# Altium project An_IF_Converter_V1.0.PrjPcb
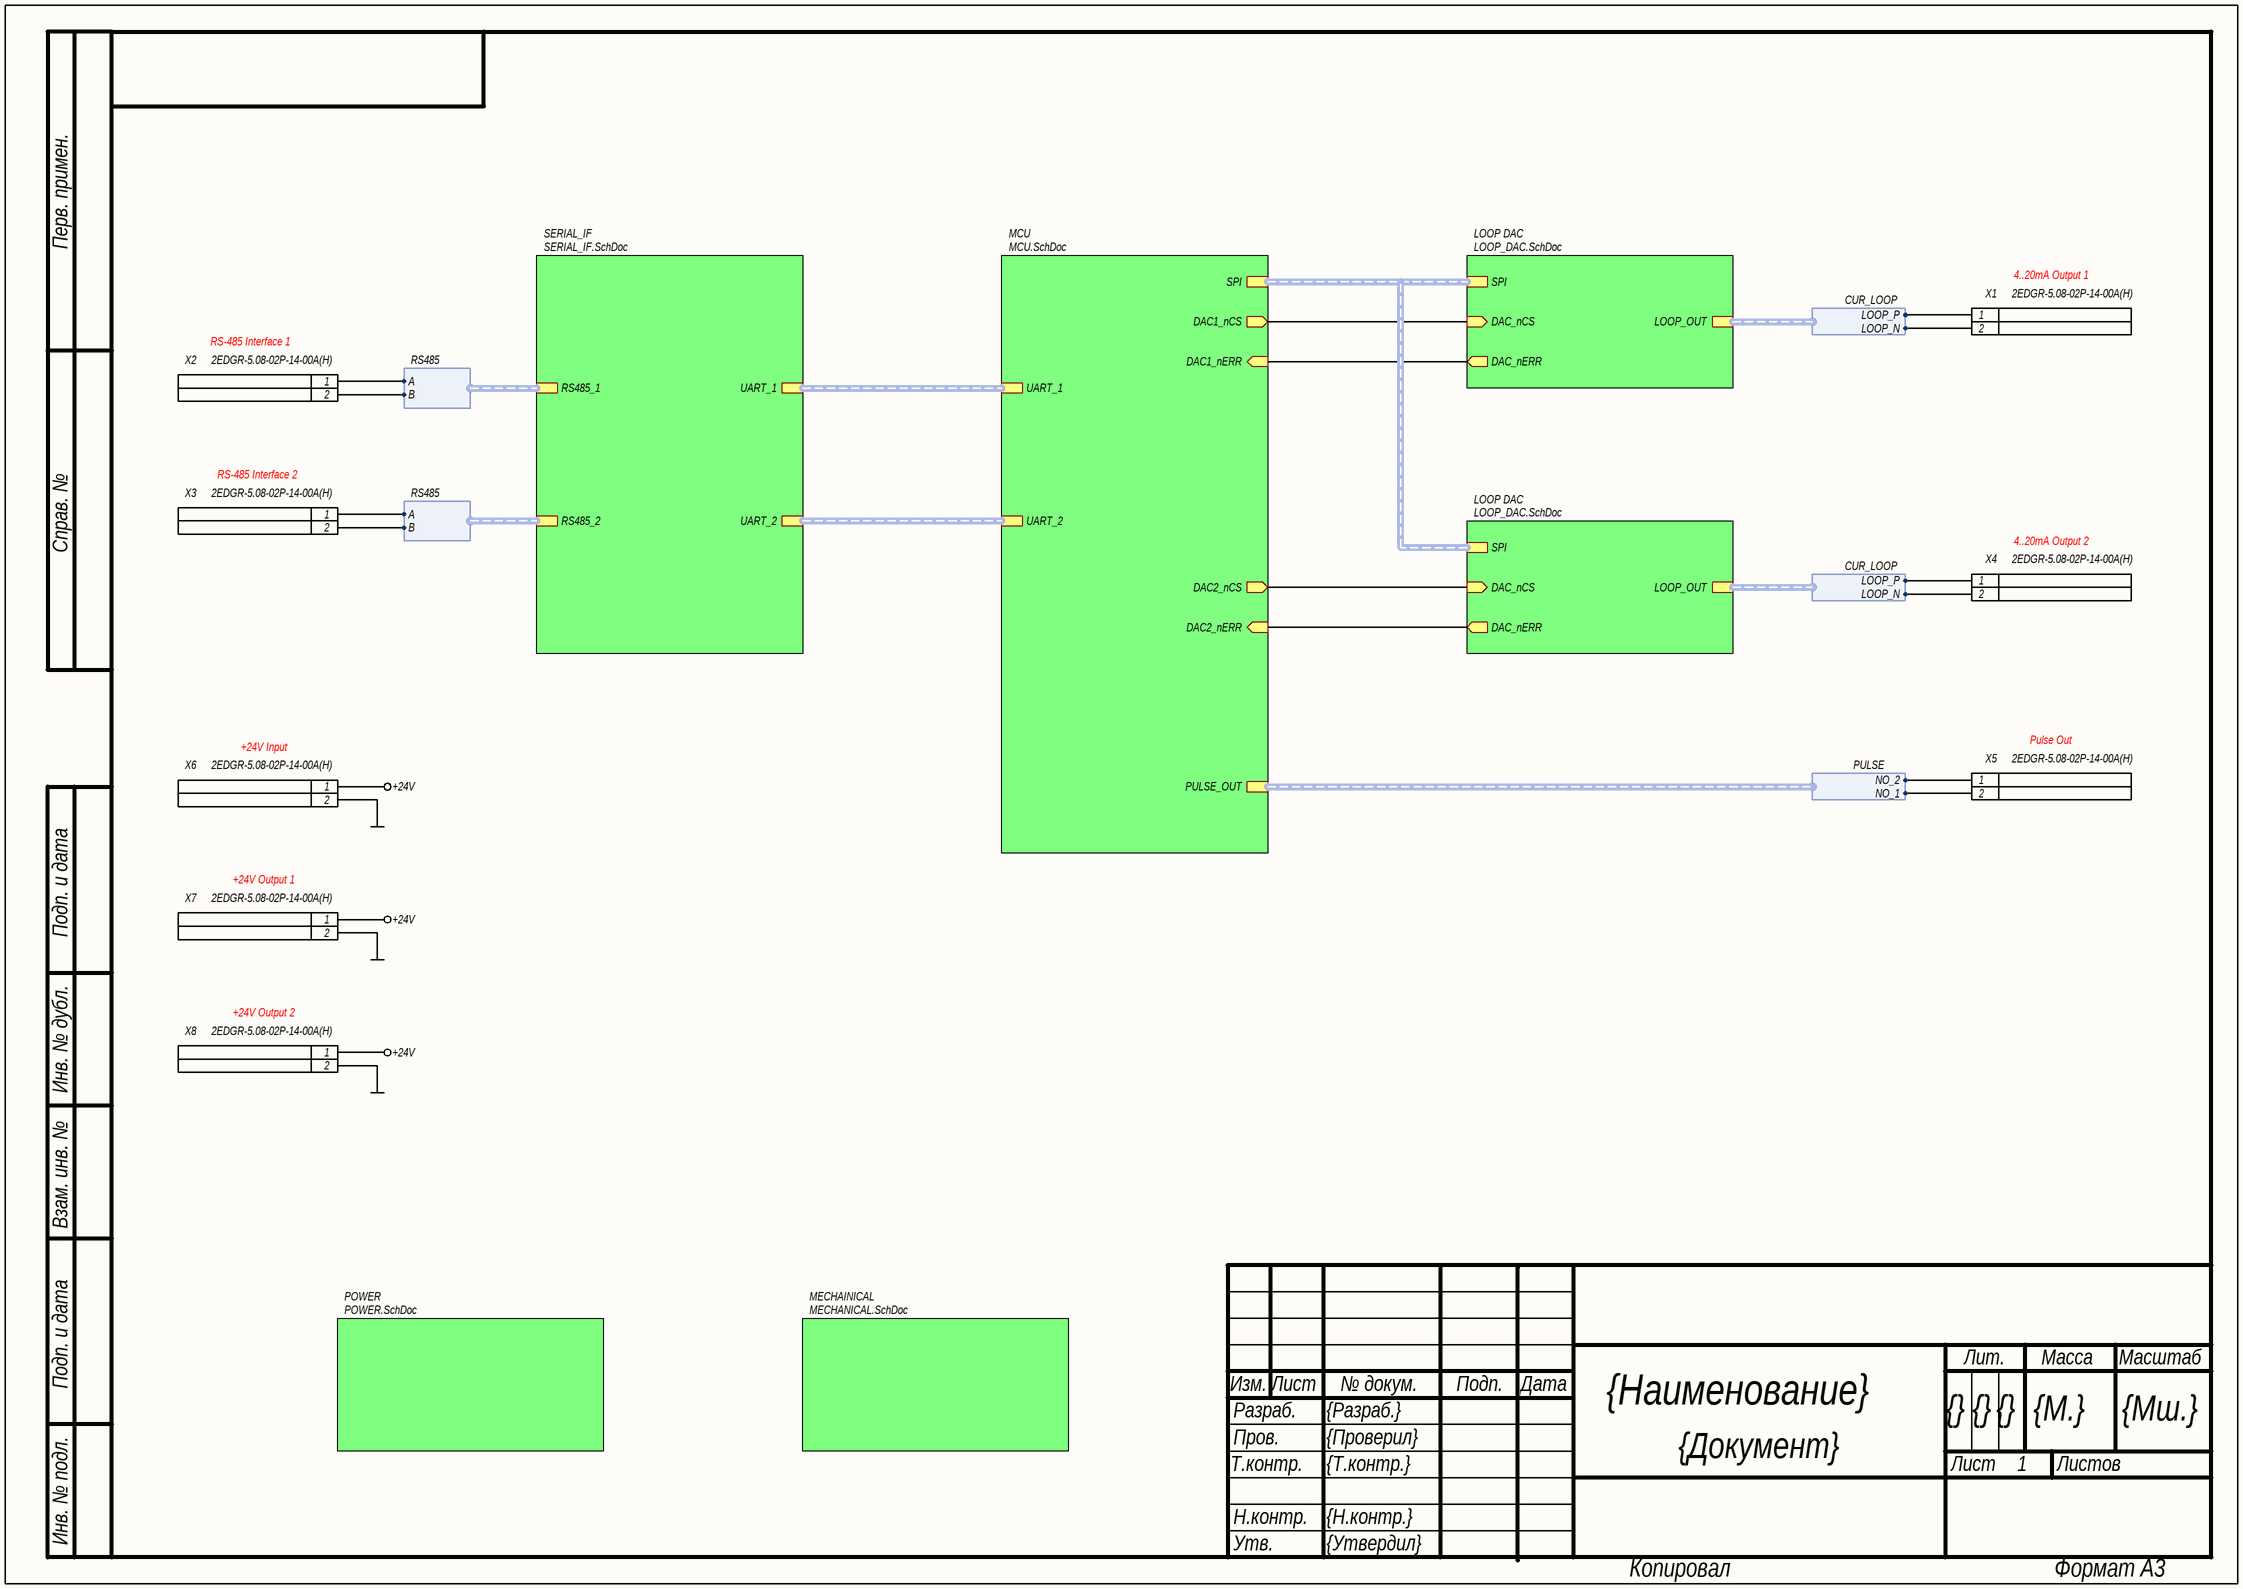
[diagram p0: TOP.SchDoc]
Total_Sheets: 6; Project_Name: AN IF Converter v.1.0
6 sheets, 157 parts. Net scope: hierarchical (ports join the sheet entries above them; power ports are global).
Board file: AN_IF_Converter_V1.0.PcbDoc
Sheets:
  TOP.SchDoc
    LOOP DAC = LOOP_DAC.SchDoc
    LOOP DAC = LOOP_DAC.SchDoc
    MCU = MCU.SchDoc
    SERIAL_IF = SERIAL_IF.SchDoc
    POWER = POWER.SchDoc
    MECHAINICAL = MECHANICAL.SchDoc

## Sheet TOP.SchDoc: {Наименование}
size 420 x 297 mm; ApprovedBy: {Утвердил}; CheckedBy: {Проверил}; DrawnBy: {Разраб.}; DocumentNumber: AN IF Converter v.1.0; SheetNumber: 1; SheetTotal: 6; Scale: {Мш.}; PageSetup: Record=PageOptions|CenterHorizontal=False|CenterVertical=False|PrintScale=0.95|XCorrection=0.00|YCorrection=0.00|PrintKind=1|BorderSize=5000000|LeftOffset=0|BottomOffset=0|Orientation=1|PaperLength=1000|PaperWidth=1000|Scale=100|PaperSource=15|PrintQuality=600|MediaType=1|DitherType=10|PaperKind=A4|PrintScaleMode=1; ProcessInspection: {Т.контр.}; Mass: {М.}; NormInspection: {Н.контр.}; Letter1Column: {}; Letter2Column: {}; Letter3Column: {}; DocumentType: {Документ}; Rule: PcbType=ProtelPcb

### Parts
X1  2EDGR-5.08-02P-14-00A(H)  [2EDGR-5.08-02P-14-00A(H)]
X2  2EDGR-5.08-02P-14-00A(H)  [2EDGR-5.08-02P-14-00A(H)]
X3  2EDGR-5.08-02P-14-00A(H)  [2EDGR-5.08-02P-14-00A(H)]
X4  2EDGR-5.08-02P-14-00A(H)  [2EDGR-5.08-02P-14-00A(H)]
X5  2EDGR-5.08-02P-14-00A(H)  [2EDGR-5.08-02P-14-00A(H)]
X6  2EDGR-5.08-02P-14-00A(H)  [2EDGR-5.08-02P-14-00A(H)]
X7  2EDGR-5.08-02P-14-00A(H)  [2EDGR-5.08-02P-14-00A(H)]
X8  2EDGR-5.08-02P-14-00A(H)  [2EDGR-5.08-02P-14-00A(H)]

### Sub-sheets
LOOP DAC = LOOP_DAC.SchDoc: DAC_nCS (in), DAC_nERR (out), LOOP_OUT (harness CUR_LOOP), SPI (harness SPI)
LOOP DAC = LOOP_DAC.SchDoc: DAC_nCS (in), DAC_nERR (out), LOOP_OUT (harness CUR_LOOP), SPI (harness SPI)
MCU = MCU.SchDoc: DAC1_nERR (in), SPI (harness SPI), DAC1_nCS (out), DAC2_nCS (out), DAC2_nERR (in), UART_2 (harness UART_CTRL), PULSE_OUT (harness PULSE), UART_1 (harness UART_CTRL)
MECHAINICAL = MECHANICAL.SchDoc: no entries
POWER = POWER.SchDoc: no entries
SERIAL_IF = SERIAL_IF.SchDoc: RS485_2 (harness RS485), RS485_1 (harness RS485), UART_2 (harness UART_CTRL), UART_1 (harness UART_CTRL)

### Harnesses
CUR_LOOP: LOOP_P, LOOP_N
RS485: A, B
PULSE: NO_1, NO_2

### Nets
+24V: X6.1 X7.1 X8.1
GND: X6.2 X7.2 X8.2
MCU_DAC1_nCS: sheet LOOP DAC/DAC_nCS, sheet MCU/DAC1_nCS
MCU_DAC1_nERR: sheet LOOP DAC/DAC_nERR, sheet MCU/DAC1_nERR
MCU_DAC2_nCS: sheet LOOP DAC/DAC_nCS, sheet MCU/DAC2_nCS
MCU_DAC2_nERR: sheet LOOP DAC/DAC_nERR, sheet MCU/DAC2_nERR
RS485_A_N: X2.2 ; sheet SERIAL_IF/RS485_1.B
RS485_A_P: X2.1 ; sheet SERIAL_IF/RS485_1.A
RS485_B_N: X3.2 ; sheet SERIAL_IF/RS485_2.B
RS485_B_P: X3.1 ; sheet SERIAL_IF/RS485_2.A
Net1DA2_5: X1.2 ; sheet LOOP DAC/LOOP_OUT.LOOP_N
Net1FU1_1: X1.1 ; sheet LOOP DAC/LOOP_OUT.LOOP_P
Net2DA2_5: X4.2 ; sheet LOOP DAC/LOOP_OUT.LOOP_N
Net2FU1_1: X4.1 ; sheet LOOP DAC/LOOP_OUT.LOOP_P
NetFU2_1: X5.1 ; sheet MCU/PULSE_OUT.NO_2
NetU1_4: X5.2 ; sheet MCU/PULSE_OUT.NO_1

### Buses and harness runs
harness sheet LOOP DAC/SPI = sheet MCU/SPI
harness sheet MCU/UART_1 = sheet SERIAL_IF/UART_1
harness sheet MCU/UART_2 = sheet SERIAL_IF/UART_2

### Notes on the sheet
- (near X1) 4..20mA Output 1
- (near X2) RS-485 Interface 1
- (near X3) RS-485 Interface 2
- (near X4) 4..20mA Output 2
- Pulse Out
- +24V Input
- (near X7) +24V Output 1
- (near X8) +24V Output 2
- Перв. примен.
- Справ. №
- Подп. и дата
- Инв. № дубл.
- Взам. инв. №
- Изм.
- Лист
- № докум.
- Подп.
- Дата
- Лит.
- Масса
- Масштаб
- Т.контр.
- Пров.
- Разраб.
- Листов
- Инв. № подл.
- Н.контр.
- Утв.
- Копировал
- Формат А3

### Library data of the parts
X1-X8 = 2EDGR-5.08-02P-14-00A(H): Разъем, 2 контакта; Тип разъема: Pluggable terminal block; Количество контактов: 2; Шаг контактов: 5.08mm; Ток: 20A; Напряжение: 320V; Производитель: Degson Electronics; Описание: Pluggable terminal block; 5.08m; ways: 2; angled 90; socket; male; Температурный диапазон: -40°C ~ 105°C; Вид монтажа: Through Hole; Артикул: 2EDGR-5.08-02P-14-00A(H); Строка для документации: https://static.chipdip.ru/lib/044/DOC013044846.pdf; Тип элемента: Разъем

## Sheet LOOP_DAC.SchDoc: {Наименование}
size 420 x 297 mm; ApprovedBy: {Утвердил}; CheckedBy: {Проверил}; DrawnBy: {Разраб.}; DocumentNumber: AN IF Converter v.1.0; SheetNumber: 2; SheetTotal: 6; Scale: {Мш.}; PageSetup: Record=PageOptions|CenterHorizontal=False|CenterVertical=False|PrintScale=0.95|XCorrection=0.00|YCorrection=0.00|PrintKind=1|BorderSize=5000000|LeftOffset=0|BottomOffset=0|Orientation=1|PaperLength=1000|PaperWidth=1000|Scale=100|PaperSource=15|PrintQuality=600|MediaType=1|DitherType=10|PaperKind=A4|PrintScaleMode=1; ProcessInspection: {Т.контр.}; Mass: {М.}; NormInspection: {Н.контр.}; Letter1Column: {}; Letter2Column: {}; Letter3Column: {}; DocumentType: {Документ}; Rule: PcbType=ProtelPcb
Used 2 times, as channels LOOP DAC, LOOP DAC. Parts and nets are listed once, with the designators drawn on the sheet.
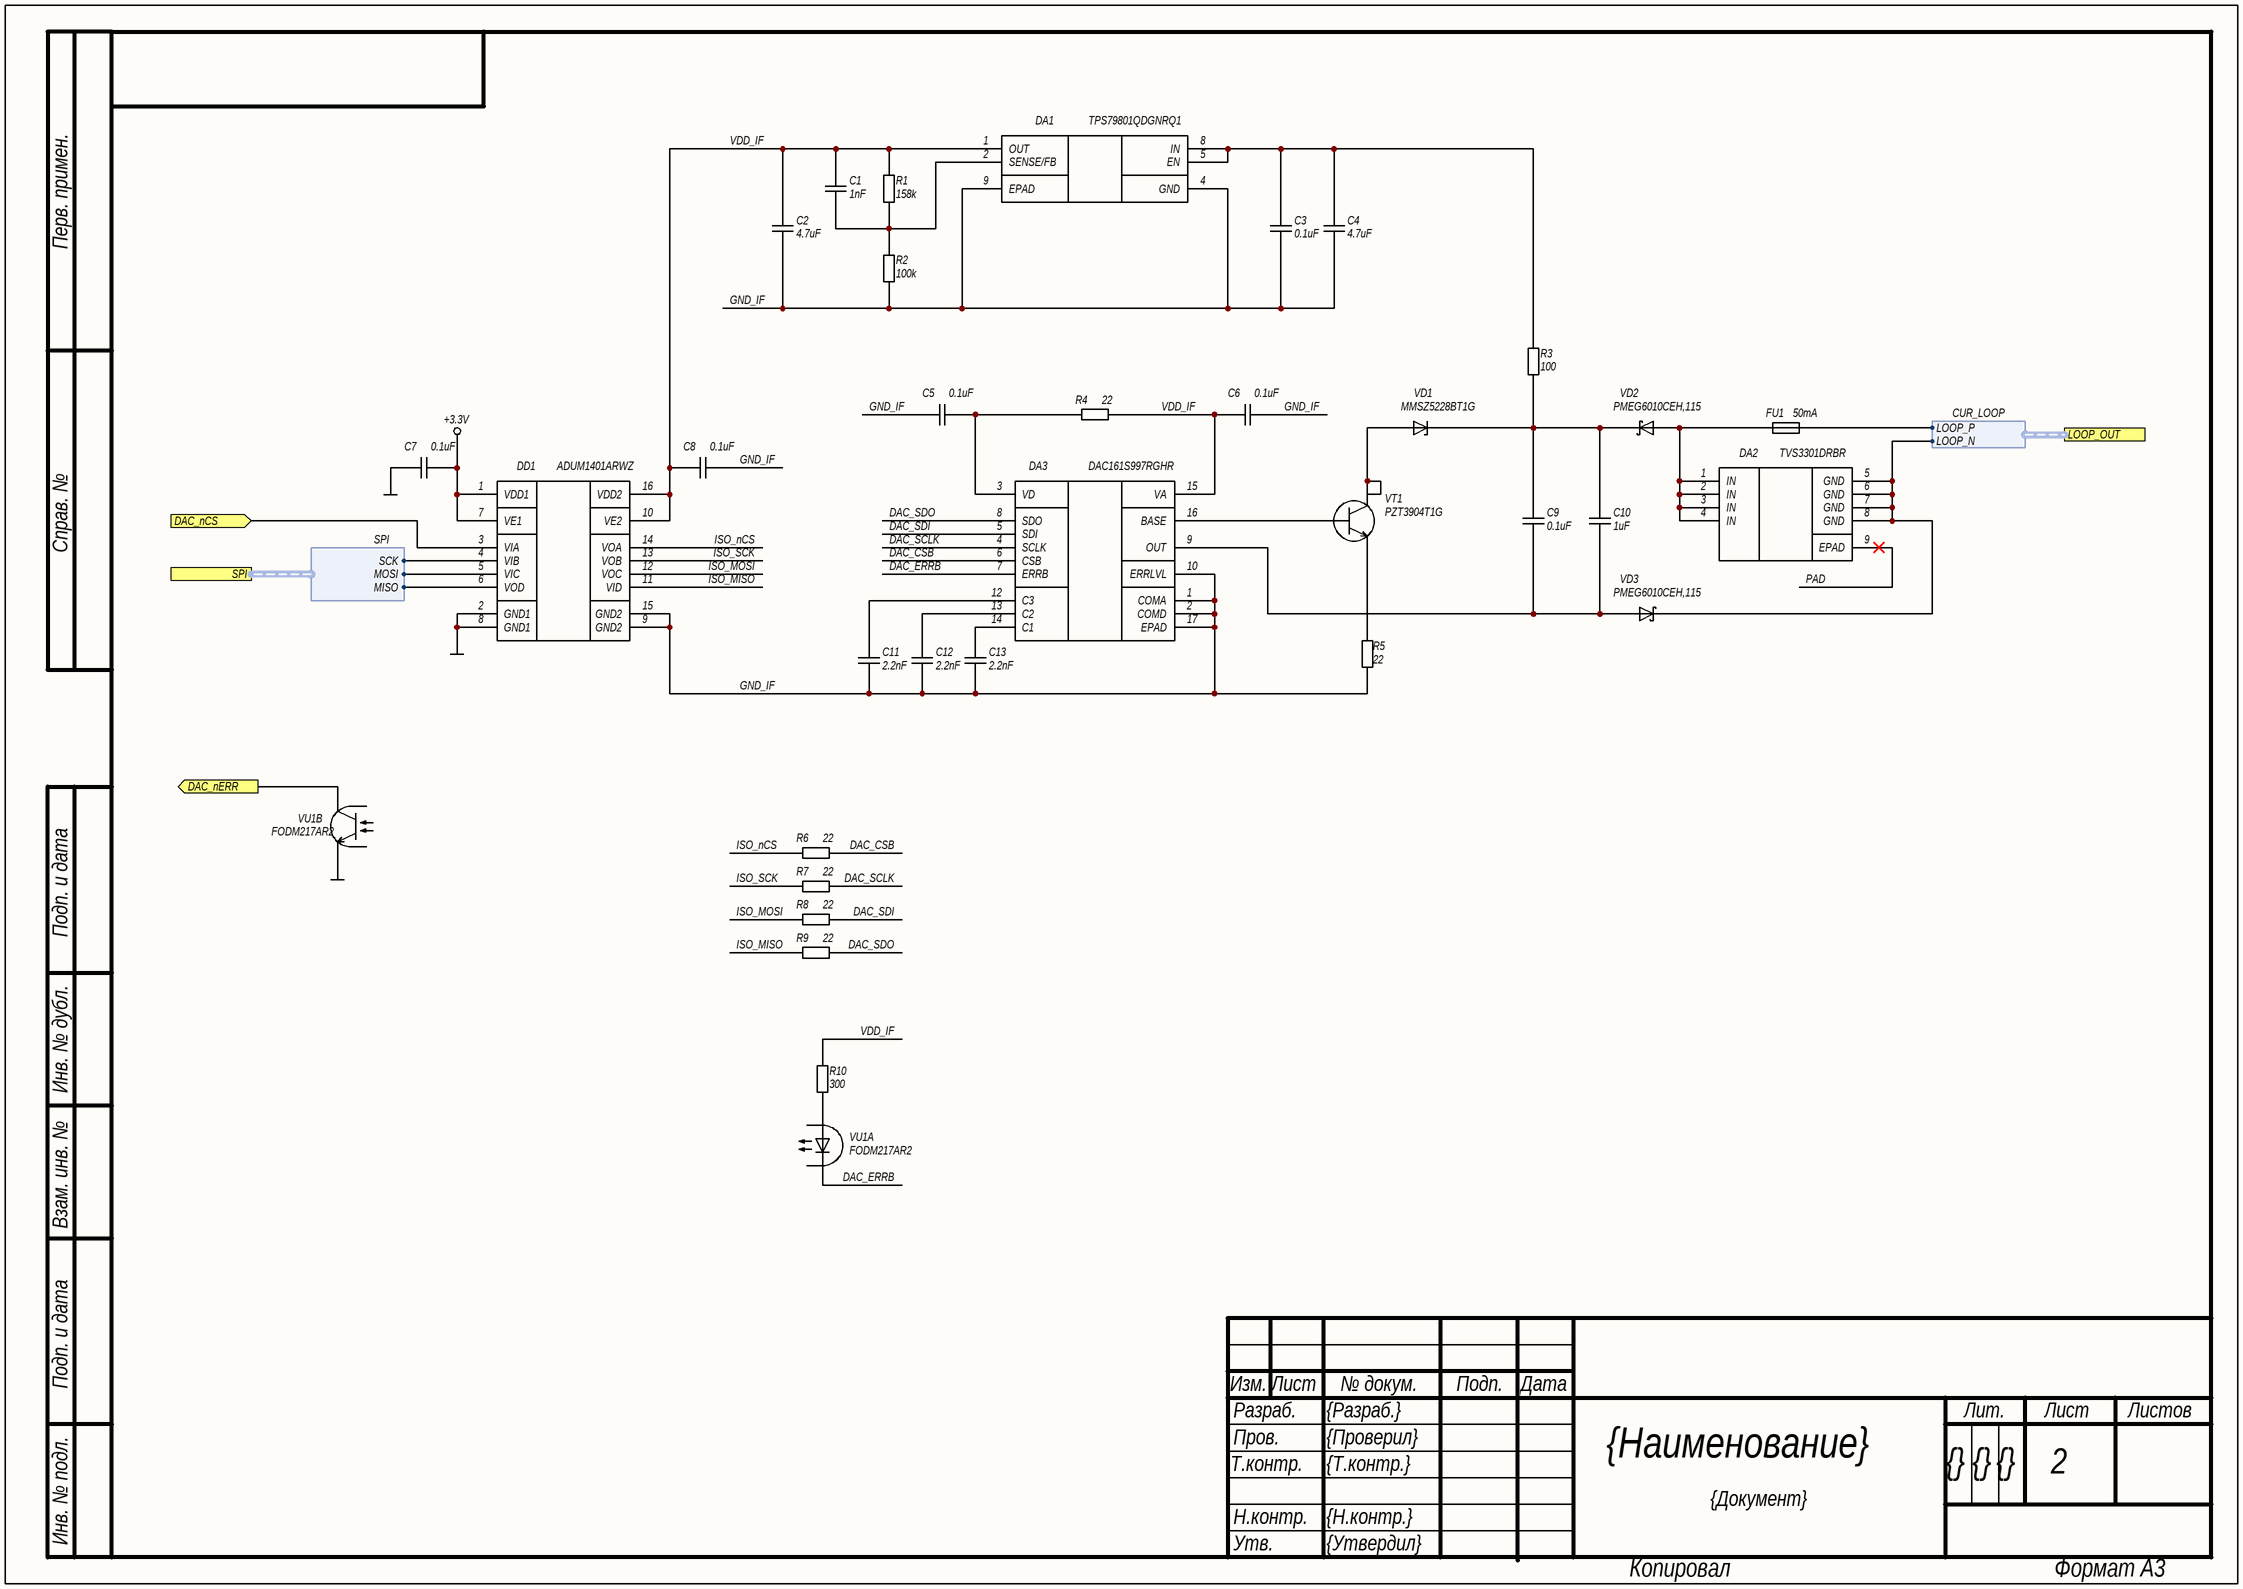
[diagram p1: LOOP_DAC.SchDoc]

### Parts
C1  1nF  [C0603N]
C2  4.7uF  [C0805N]
C3  0.1uF  [C0603N]
C4  4.7uF  [C1206N]
C5  0.1uF  [C0603N]
C6  0.1uF  [C0603N]
C7  0.1uF  [C0603N]
C8  0.1uF  [C0603N]
C9  0.1uF  [C0603N]
C10  1uF  [C0603N]
C11  2.2nF  [C0603N]
C12  2.2nF  [C0603N]
C13  2.2nF  [C0603N]
DA1  TPS79801QDGNRQ1  [DGN0008B]
DA2  TVS3301DRBR  [DRB0008A]
DA3  DAC161S997RGHR  [RGH0016A]
DD1  ADUM1401ARWZ  [SOIC16_W]
FU1  50mA  [0ZCJ_0.85]
R1  158k  [R0603N]
R2  100k  [R0603N]
R3  100  [R0603N]
R4  22  [R0603N]
R5  22  [R0603N]
R6  22  [R0603N]
R7  22  [R0603N]
R8  22  [R0603N]
R9  22  [R0603N]
R10  300  [R0603N]
VD1  MMSZ5228BT1G  [SOD123]
VD2  PMEG6010CEH,115  [SOD123F]
VD3  PMEG6010CEH,115  [SOD123F]
VT1  PZT3904T1G  [SOT223]
VU1  FODM217AR2  [MFP4 2.5x4.4]  (parts A,B of 2)

### Ports
DAC_nCS (in), DAC_nERR (out), LOOP_OUT (harness CUR_LOOP), SPI (harness SPI)

### Harnesses
SPI: MISO, MOSI, SCK
CUR_LOOP: LOOP_P, LOOP_N

### Nets
+3.3V: C7.1 DD1.1(VDD1) DD1.7(VE1)
GND: C7.2 DD1.2(GND1) DD1.8(GND1) VU1.3(E)
DAC_CSB: DA3.6(CSB) R6.1
DAC_ERRB: DA3.7(ERRB) VU1.2(K)
DAC_nCS: DD1.3(VIA) ; port DAC_nCS
DAC_nERR: VU1.4(C) ; port DAC_nERR
DAC_SCLK: DA3.4(SCLK) R7.1
DAC_SDI: DA3.5(SDI) R8.1
DAC_SDO: DA3.8(SDO) R9.1
GND_IF: C2.2 C3.1 C4.2 C5.2 C6.1 C8.1 C11.1 C12.1 C13.1 DA1.4(GND) DA1.9(EPAD) DA3.1(COMA) DA3.2(COMD) DA3.10(ERRLVL) DA3.17(EPAD) DD1.9(GND2) DD1.15(GND2) R2.2 R5.2
ISO_MISO: DD1.11(VID) R9.2
ISO_MOSI: DD1.12(VOC) R8.2
ISO_nCS: DD1.14(VOA) R6.2
ISO_SCK: DD1.13(VOB) R7.2
PAD: DA2.9(EPAD)
VDD_IF: C1.1 C2.1 C6.2 C8.2 DA1.1(OUT) DA3.15(VA) DD1.10(VE2) DD1.16(VDD2) R1.1 R4.1 R10.1
NetC1_2: C1.2 DA1.2(SENSE/FB) R1.2 R2.1
NetC3_2: C3.2 C4.1 DA1.5(EN) DA1.8(IN) R3.1
NetC5_1: C5.1 DA3.3(VD) R4.2
NetC9_1: C9.1 C10.1 R3.2 VD1.1(K) VD2.1(K)
NetC9_2: C9.2 C10.2 DA3.9(OUT) VD3.2(A)
NetC11_2: C11.2 DA3.12(C3)
NetC12_2: C12.2 DA3.13(C2)
NetC13_2: C13.2 DA3.14(C1)
NetDA2_1: DA2.1(IN) DA2.2(IN) DA2.3(IN) DA2.4(IN) FU1.2 VD2.2(A)
NetDA2_5: DA2.5(GND) DA2.6(GND) DA2.7(GND) DA2.8(GND) VD3.1(K) ; port LOOP_OUT.LOOP_N
NetDA3_16: DA3.16(BASE) VT1.1(B)
NetDD1_4: DD1.4(VIB) ; port SPI.SCK
NetDD1_5: DD1.5(VIC) ; port SPI.MOSI
NetDD1_6: DD1.6(VOD) ; port SPI.MISO
NetFU1_1: FU1.1 ; port LOOP_OUT.LOOP_P
NetR5_1: R5.1 VT1.3(E)
NetR10_2: R10.2 VU1.1(A)
NetVD1_2: VD1.2(A) VT1.2(C) VT1.4(C)

### Channels
LOOP DAC: designators C1=1C1 C2=1C2 C3=1C3 C4=1C4 C5=1C5 C6=1C6 C7=1C7 C8=1C8 C9=1C9 C10=1C10 C11=1C11 C12=1C12 C13=1C13 DA1=1DA1 DA2=1DA2 DA3=1DA3 DD1=1DD1 FU1=1FU1 R1=1R1 R2=1R2 R3=1R3 R4=1R4 R5=1R5 R6=1R6 R7=1R7 R8=1R8 R9=1R9 R10=1R10 VD1=1VD1 VD2=1VD2 VD3=1VD3 VT1=1VT1 VU1=1VU1; ports DAC_nCS=MCU_DAC1_nCS DAC_nERR=MCU_DAC1_nERR
LOOP DAC: designators C1=2C1 C2=2C2 C3=2C3 C4=2C4 C5=2C5 C6=2C6 C7=2C7 C8=2C8 C9=2C9 C10=2C10 C11=2C11 C12=2C12 C13=2C13 DA1=2DA1 DA2=2DA2 DA3=2DA3 DD1=2DD1 FU1=2FU1 R1=2R1 R2=2R2 R3=2R3 R4=2R4 R5=2R5 R6=2R6 R7=2R7 R8=2R8 R9=2R9 R10=2R10 VD1=2VD1 VD2=2VD2 VD3=2VD3 VT1=2VT1 VU1=2VU1; ports DAC_nCS=MCU_DAC2_nCS DAC_nERR=MCU_DAC2_nERR

### Notes on the sheet
- Перв. примен.
- Справ. №
- Подп. и дата
- Инв. № дубл.
- Взам. инв. №
- Изм.
- Лист
- № докум.
- Подп.
- Дата
- Т.контр.
- Пров.
- Разраб.
- Лит.
- Листов
- Инв. № подл.
- Н.контр.
- Утв.
- Копировал
- Формат А3

### Library data of the parts
C1 = CL10B102KC8NNNC: Конденсатор; Точность: 10%; Напряжение: 100V; Диэлектрик: X7R; Производитель: Samsung Electro-Mechanics; Описание: 1000 pF ±10% 100V Ceramic Capacitor X7R 0603 (1608 Metric); Корпус: 0603 (1608 Metric); Температурный диапазон: -55°C ~ 125°C; Вид монтажа: SMD; Артикул: CL10B102KC8NNNC; Номинал: 1nF; Строка для документации: https://mm.digikey.com/Volume0/opasdata/d220001/medias/docus/1136/CL10B102KC8NNNC_Spec.pdf; Тип элемента: Конденсатор
C2 = CL21A475KAQNNNG: Конденсатор; Точность: 10%; Напряжение: 25V; Диэлектрик: X5R; Производитель: Samsung Electro-Mechanics; Описание: 4.7 µF ±10% 25V Ceramic Capacitor X5R 0805 (2012 Metric); Корпус: 0805 (2012 Metric); Температурный диапазон: -55°C ~ 85°C; Вид монтажа: SMD; Артикул: CL21A475KAQNNNG; Номинал: 4.7uF; Строка для документации: https://mm.digikey.com/Volume0/opasdata/d220001/medias/docus/41/CL21A475KAQNNNG_DS.pdf; Тип элемента: Конденсатор
C3 C5-C9 = CL10B104KB8NNNC: Конденсатор; Точность: 10%; Напряжение: 50V; Диэлектрик: X7R; Производитель: Samsung Electro-Mechanics; Описание: 0.1 µF ±10% 50V Ceramic Capacitor X7R 0603 (1608 Metric); Корпус: 0603 (1608 Metric); Температурный диапазон: -55°C ~ 125°C; Вид монтажа: SMD; Артикул: CL10B104KB8NNNC; Номинал: 0.1uF; Строка для документации: https://mm.digikey.com/Volume0/opasdata/d220001/medias/docus/609/CL10B104KB8NNNC_Spec.pdf; Тип элемента: Конденсатор
C4 = CC1206KKX7R9BB475: Конденсатор; Точность: 10%; Напряжение: 50V; Диэлектрик: X7R; Производитель: YAGEO; Описание: 4.7 µF ±10% 50V Ceramic Capacitor X7R 1206 (3216 Metric); Корпус: 1206 (3216 Metric); Строка для документации: ttps://www.yageo.com/upload/media/product/productsearch/datasheet/mlcc/UPY-NP0X7R_HV_1KV-to-3KV_13.pdf; Температурный диапазон: -55°C ~ 125°C; Вид монтажа: SMD; Артикул: CC1206KKX7R9BB475; Номинал: 4.7uF; Тип элемента: Конденсатор
C10 = CC0603KRX7R9BB105: Конденсатор; Точность: 10%; Напряжение: 50V; Диэлектрик: X7R; Производитель: YAGEO; Описание: 1 µF ±10% 50V Ceramic Capacitor X7R 0603 (1608 Metric); Корпус: 0603 (1608 Metric); Температурный диапазон: -55°C ~ 125°C; Вид монтажа: SMD; Артикул: CC0603KRX7R9BB105; Номинал: 1uF; Строка для документации: https://www.yageo.com/upload/media/product/productsearch/datasheet/mlcc/UPY-GPHC_X7R_6.3V-to-250V_24.pdf; Тип элемента: Конденсатор
C11-C13 = CC0603JRNPO9BN222: Конденсатор; Точность: 5%; Напряжение: 50V; Диэлектрик: NP0; Производитель: YAGEO; Описание: 2200 pF ±5% 50V Ceramic Capacitor C0G, NP0 0603 (1608 Metric); Корпус: 0603 (1608 Metric); Температурный диапазон: -55°C ~ 125°C; Вид монтажа: SMD; Артикул: CC0603JRNPO9BN222; Номинал: 2.2nF; Строка для документации: https://www.yageo.com/upload/media/product/productsearch/datasheet/mlcc/UPY-GPHC_X7R_6.3V-to-250V_24.pdf; Тип элемента: Конденсатор
DA1 = TPS79801QDGNRQ1: Микросхема линейный стабилизатор напряжения; Производитель: Texas Instruments; Описание: Linear Voltage Regulator IC Positive Adjustable 1 Output 50mA 8-HVSSOP; Корпус: 8-HVSSOP; Температурный диапазон: -40°C ~ 125°C; Вид монтажа: SMD; Артикул: TPS79801QDGNRQ1; Строка для документации: https://www.ti.com/lit/ds/symlink/tps798-q1.pdf; Тип элемента: Микросхема
DA2 = TVS3301DRBR: Микросхема ограничитель выбросов напряжения; Напряжение: 33V; Напряжение ограничения: 42.5V; Напряжение пробоя: 37.5V; Ток: 27A; Тип: TVS Unidirectional; Производитель: Texas Instruments; Описание: Mixed Technology TVS Device Circuit 42.5V Surface Mount 8-SON (3x3); Корпус: 8-SON (3x3); Температурный диапазон: -40°C ~ 125°C (TA); Вид монтажа: SMD; Тип элемента: Диод защитный; Артикул: TVS3301DRBR; Строка для документации: https://www.ti.com/lit/ds/symlink/tvs3301.pdf
DA3 = DAC161S997RGHR: Микросхема 16-бит ЦАП с токовым выходом 4-20mA; Производитель: Texas Instruments; Описание: 16-Bit SPI-Programmable DAC for 4-20 mA Loops 16-WQFN (4x4); Корпус: 16-WFQFN Exposed Pad; Температурный диапазон: -40°C ~ 105°C; Вид монтажа: SMD; Артикул: DAC161S997RGHR; Строка для документации: https://www.ti.com/lit/ds/symlink/dac161s997.pdf; Тип элемента: Микросхема
DD1 = ADUM1401ARWZ: Микросхема цифровой изолятор интерфейса; Производитель: Analog Devices Inc.; Описание: General Purpose Digital Isolator 2500Vrms 4 Channel 1Mbps 25kV/µs CMTI 16-SOIC (0.295", 7.50mm Width); Корпус: 16-SOIC (0.295", 7.50mm Width); Температурный диапазон: -40°C ~ 105°C; Вид монтажа: SMD; Артикул: ADUM1401ARWZ; Строка для документации: https://www.analog.com/media/en/technical-documentation/data-sheets/ADuM1400_1401_1402.pdf; Тип элемента: Микросхема
FU1 = 0ZCJ0005FF2E: Плавкий предохранитель; Напряжение: 60V; Тип: PTC Resettable Fuse; Производитель: Bel Fuse Inc.; Описание: Polymeric PTC Resettable Fuse 60V 50 mA Ih Surface Mount 1206 (3216 Metric), Concave; Корпус: 1206 (3216 Metric), Concave; Температурный диапазон: -40°C ~ 85°C; Вид монтажа: SMD; Артикул: 0ZCJ0005FF2E; Ток: 50mA; Строка для документации: https://www.belfuse.com/resources/datasheets/circuitprotection/ds-cp-0zcj-series.pdf; Тип элемента: Предохранитель
R1 = RC0603FR-07158KL: Резистор; Точность: 1%; ТКС: ±100ppm/°C; Напряжение: 75V; Производитель: YAGEO; Описание: 158 kOhms ±1% 0.1W, 1/10W Chip Resistor 0603 (1608 Metric) Moisture Resistant Thick Film; Корпус: 0603 (1608 Metric); Температурный диапазон: -55°C ~ 155°C; Вид монтажа: SMD; Артикул: RC0603FR-07158KL; Номинал: 158k; Строка для документации: https://www.yageo.com/upload/media/product/app/datasheet/rchip/pyu-rc_group_51_rohs_l.pdf; Тип элемента: Резистор
R2 = RC0603FR-07100KL: Резистор; Точность: 1%; ТКС: ±100ppm/°C; Напряжение: 75V; Производитель: YAGEO; Описание: 100 kOhms ±1% 0.1W, 1/10W Chip Resistor 0603 (1608 Metric) Moisture Resistant Thick Film; Корпус: 0603 (1608 Metric); Температурный диапазон: -55°C ~ 155°C; Вид монтажа: SMD; Артикул: RC0603FR-07100KL; Номинал: 100k; Строка для документации: https://www.yageo.com/upload/media/product/app/datasheet/rchip/pyu-rc_group_51_rohs_l.pdf; Тип элемента: Резистор
R3 = RC0603FR-07100RL: Резистор; Точность: 1%; ТКС: ±100ppm/°C; Напряжение: 75V; Производитель: YAGEO; Описание: 100 Ohms ±1% 0.1W, 1/10W Chip Resistor 0603 (1608 Metric) Moisture Resistant Thick Film; Корпус: 0603 (1608 Metric); Температурный диапазон: -55°C ~ 155°C; Вид монтажа: SMD; Артикул: RC0603FR-07100RL; Номинал: 100; Строка для документации: https://www.yageo.com/upload/media/product/app/datasheet/rchip/pyu-rc_group_51_rohs_l.pdf; Тип элемента: Резистор
R4-R9 = RC0603FR-0722RL: Резистор; Точность: 1%; ТКС: ±100ppm/°C; Напряжение: 75V; Производитель: YAGEO; Описание: 22 Ohms ±1% 0.1W, 1/10W Chip Resistor 0603 (1608 Metric) Moisture Resistant Thick Film; Корпус: 0603 (1608 Metric); Температурный диапазон: -55°C ~ 155°C; Вид монтажа: SMD; Артикул: RC0603FR-0722RL; Номинал: 22; Строка для документации: https://www.yageo.com/upload/media/product/app/datasheet/rchip/pyu-rc_group_51_rohs_l.pdf; Тип элемента: Резистор
R10 = RC0603FR-07300RL: Резистор; Точность: 1%; ТКС: ±100ppm/°C; Напряжение: 75V; Производитель: YAGEO; Описание: 300 Ohms ±1% 0.1W, 1/10W Chip Resistor 0603 (1608 Metric) Moisture Resistant Thick Film; Корпус: 0603 (1608 Metric); Температурный диапазон: -55°C ~ 155°C; Вид монтажа: SMD; Артикул: RC0603FR-07300RL; Номинал: 300; Строка для документации: https://www.yageo.com/upload/media/product/app/datasheet/rchip/pyu-rc_group_51_rohs_l.pdf; Тип элемента: Резистор
VD1 = MMSZ5228BT1G: Стабилитрон; Прямой ток: 20mA; Напряжение: 3.9V; Производитель: onsemi; Описание: Zener Diode 3.9 V 500 mW ±5% Surface Mount SOD-123; Корпус: SOD-123; Температурный диапазон: -55°C ~ 150°C; Вид монтажа: SMD; Тип элемента: Диод; Артикул: MMSZ5228BT1G; Тип: Zener; Строка для документации: https://www.onsemi.com/pdf/datasheet/mmsz5221bt1-d.pdf
VD2 VD3 = PMEG6010CEH,115: Диод Шоттки; Прямой ток: 1A; Напряжение: 60V; Производитель: Nexperia USA Inc.; Описание: Diode 60 V 1A Surface Mount SOD-123F; Корпус: SOD-123F; Температурный диапазон: -65°C ~ 150°C; Вид монтажа: SMD; Артикул: PMEG6010CEH,115; Тип: Schottky; Строка для документации: https://assets.nexperia.com/documents/data-sheet/PMEG6010CEH.pdf; Тип элемента: Диод
VT1 = PZT3904T1G: Биполярный транзистор, NPN структуры; Ток: 0.2A; Напряжение: 40V; Производитель: onsemi; Описание: Bipolar (BJT) Transistor NPN 40 V 200 mA 300MHz 1.5 W Surface Mount SOT-223 (TO-261); Корпус: SOT-223 (TO-261); Температурный диапазон: -55°C ~ 150°C (TJ); Вид монтажа: SMD; Тип элемента: Транзистор биполярный; Артикул: PZT3904T1G; Тип: NPN
VU1 = FODM217AR2: NPN транзисторная оптопара; Прямой ток: 50mA; Напряжение: 1.2V; Производитель: onsemi; Описание: Optoisolator Transistor Output 3750Vrms 1 Channel 4-SOP; Корпус: 4-SOIC (0.173", 4.40mm Width); Температурный диапазон: -55°C ~ 110°C; Вид монтажа: SMD; Артикул: FODM217AR2; Строка для документации: https://www.onsemi.com/pdf/datasheet/fodm214-d.pdf; Тип элемента: Транзисторная оптопара

## Sheet MCU.SchDoc: {Наименование}
size 420 x 297 mm; ApprovedBy: {Утвердил}; CheckedBy: {Проверил}; DrawnBy: {Разраб.}; DocumentNumber: AN IF Converter v.1.0; SheetNumber: 3; SheetTotal: 6; Scale: {Мш.}; PageSetup: Record=PageOptions|CenterHorizontal=False|CenterVertical=False|PrintScale=0.95|XCorrection=0.00|YCorrection=0.00|PrintKind=1|BorderSize=5000000|LeftOffset=0|BottomOffset=0|Orientation=1|PaperLength=1000|PaperWidth=1000|Scale=100|PaperSource=15|PrintQuality=600|MediaType=1|DitherType=10|PaperKind=A4|PrintScaleMode=1; ProcessInspection: {Т.контр.}; Mass: {М.}; NormInspection: {Н.контр.}; Letter1Column: {}; Letter2Column: {}; Letter3Column: {}; DocumentType: {Документ}; Rule: PcbType=ProtelPcb
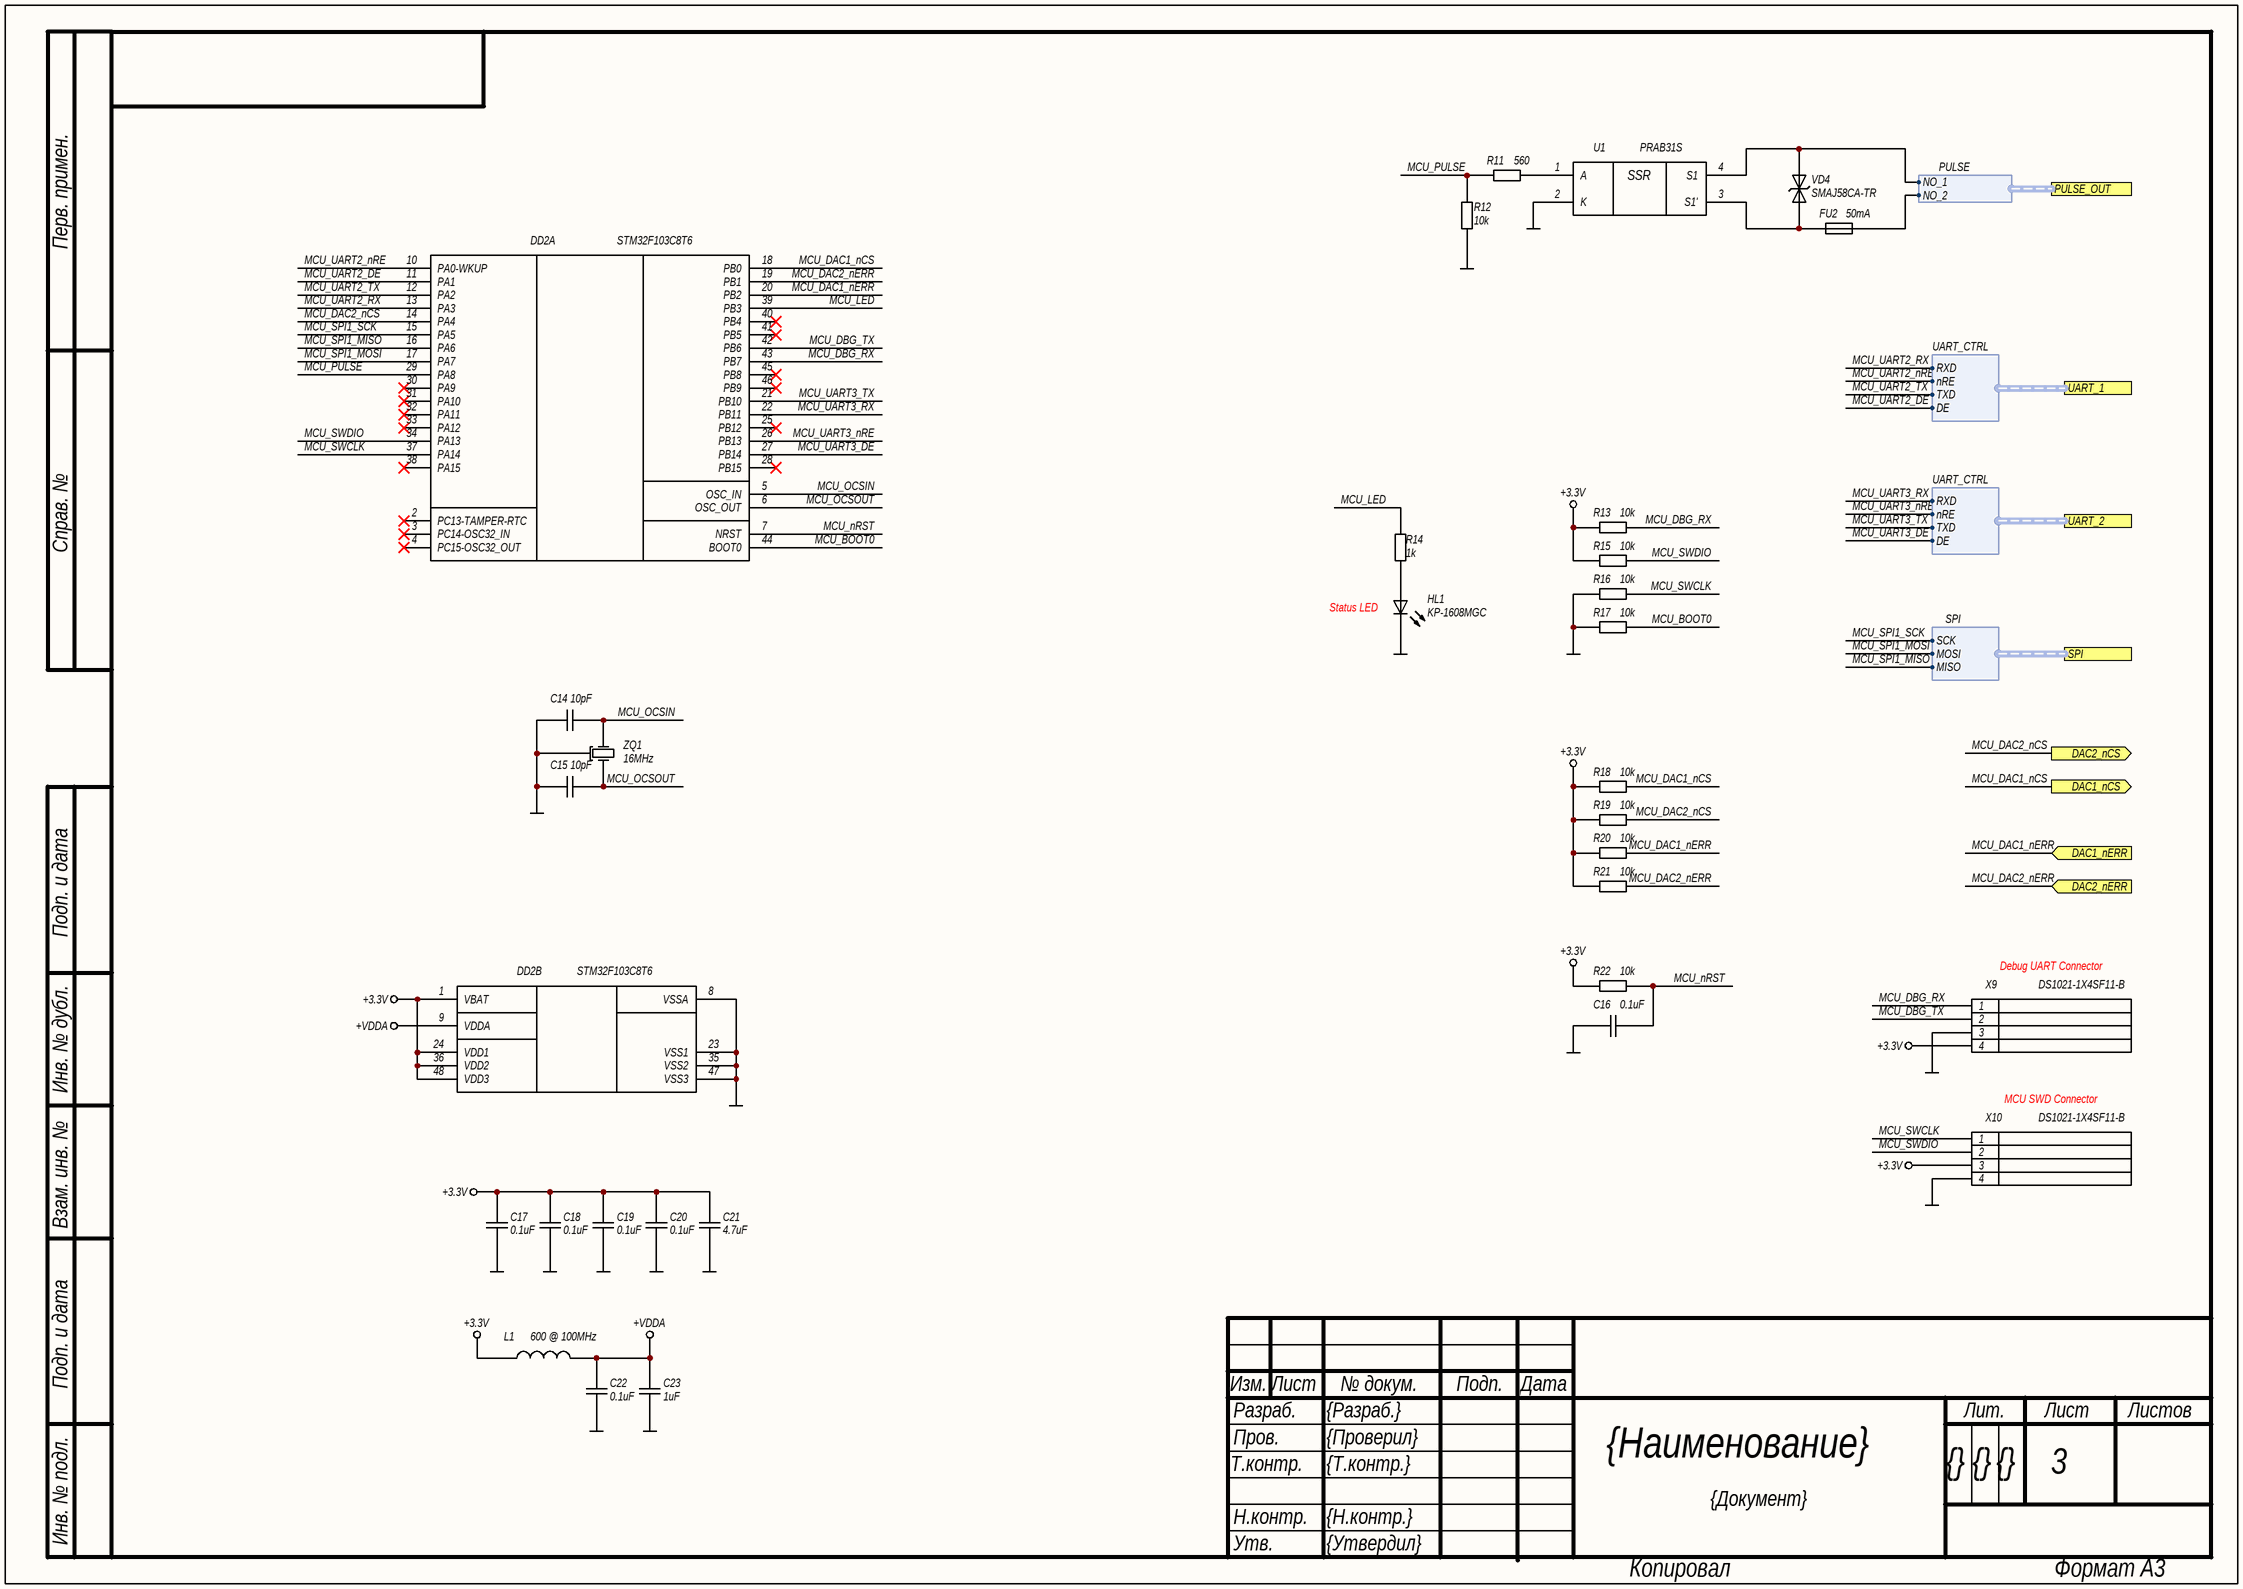
[diagram p2: MCU.SchDoc]

### Parts
C14  10pF  [C0603N]
C15  10pF  [C0603N]
C16  0.1uF  [C0603N]
C17  0.1uF  [C0603N]
C18  0.1uF  [C0603N]
C19  0.1uF  [C0603N]
C20  0.1uF  [C0603N]
C21  4.7uF  [C0805N]
C22  0.1uF  [C0603N]
C23  1uF  [C0603N]
DD2  STM32F103C8T6  [LQFP48]  (parts A,B of 2)
FU2  50mA  [0ZCJ_0.85]
HL1  KP-1608MGC  [LED0603]
L1  600 @ 100MHz  [FB0603N]
R11  560  [R0603N]
R12  10k  [R0603N]
R13  10k  [R0603N]
R14  1k  [R0603N]
R15  10k  [R0603N]
R16  10k  [R0603N]
R17  10k  [R0603N]
R18  10k  [R0603N]
R19  10k  [R0603N]
R20  10k  [R0603N]
R21  10k  [R0603N]
R22  10k  [R0603N]
U1  PRAB31S  [SOP4]
VD4  SMAJ58CA-TR  [SMA]
X9  DS1021-1X4SF11-B  [2.54_1X4_HEADER]
X10  DS1021-1X4SF11-B  [2.54_1X4_HEADER]
ZQ1  16MHz  [NX3225GA]

### Ports
DAC1_nCS (out), DAC1_nERR (in), DAC2_nCS (out), DAC2_nERR (in), PULSE_OUT (harness PULSE), SPI (harness SPI), UART_1 (harness UART_CTRL), UART_2 (harness UART_CTRL)

### Harnesses
SPI: MISO, MOSI, SCK
UART_CTRL: RXD, nRE, TXD, DE
PULSE: NO_1, NO_2

### Nets
+3.3V: C17.2 C18.2 C19.2 C20.2 C21.2 DD2.1(VBAT) DD2.24(VDD1) DD2.36(VDD2) DD2.48(VDD3) L1.1 R13.2 R15.2 R18.2 R19.2 R20.2 R21.2 R22.2 X9.4 X10.3
+VDDA: C22.2 C23.1 DD2.9(VDDA) L1.2
GND: C14.2 C15.2 C16.2 C17.1 C18.1 C19.1 C20.1 C21.1 C22.1 C23.2 DD2.8(VSSA) DD2.23(VSS1) DD2.35(VSS2) DD2.47(VSS3) HL1.1(K) R12.2 R16.2 R17.2 U1.2(K) X9.3 X10.4 ZQ1.2
MCU_BOOT0: DD2.44(BOOT0) R17.1
MCU_DAC1_nCS: DD2.18(PB0) R18.1 ; port DAC1_nCS
MCU_DAC1_nERR: DD2.20(PB2) R20.1 ; port DAC1_nERR
MCU_DAC2_nCS: DD2.14(PA4) R19.1 ; port DAC2_nCS
MCU_DAC2_nERR: DD2.19(PB1) R21.1 ; port DAC2_nERR
MCU_DBG_RX: DD2.43(PB7) R13.1 X9.1
MCU_DBG_TX: DD2.42(PB6) X9.2
MCU_LED: DD2.39(PB3) R14.1
MCU_nRST: C16.1 DD2.7(NRST) R22.1
MCU_OCSIN: C14.1 DD2.5(OSC_IN) ZQ1.3
MCU_OCSOUT: C15.1 DD2.6(OSC_OUT) ZQ1.1
MCU_PULSE: DD2.29(PA8) R11.2 R12.1
MCU_SPI1_MISO: DD2.16(PA6) ; port SPI.MISO
MCU_SPI1_MOSI: DD2.17(PA7) ; port SPI.MOSI
MCU_SPI1_SCK: DD2.15(PA5) ; port SPI.SCK
MCU_SWCLK: DD2.37(PA14) R16.1 X10.1
MCU_SWDIO: DD2.34(PA13) R15.1 X10.2
MCU_UART2_DE: DD2.11(PA1) ; port UART_1.DE
MCU_UART2_nRE: DD2.10(PA0-WKUP) ; port UART_1.nRE
MCU_UART2_RX: DD2.13(PA3) ; port UART_1.RXD
MCU_UART2_TX: DD2.12(PA2) ; port UART_1.TXD
MCU_UART3_DE: DD2.27(PB14) ; port UART_2.DE
MCU_UART3_nRE: DD2.26(PB13) ; port UART_2.nRE
MCU_UART3_RX: DD2.22(PB11) ; port UART_2.RXD
MCU_UART3_TX: DD2.21(PB10) ; port UART_2.TXD
NetFU2_1: FU2.1 ; port PULSE_OUT.NO_2
NetFU2_2: FU2.2 U1.3(S1') VD4.2(A2)
NetHL1_2: HL1.2(A) R14.2
NetR11_1: R11.1 U1.1(A)
NetU1_4: U1.4(S1) VD4.1(A1) ; port PULSE_OUT.NO_1

Not connected (* = marked no-connect by the designer): DD2 2(PC13-TAMPER-RTC)* 3(PC14-OSC32_IN)* 4(PC15-OSC32_OUT)* 25(PB12)* 28(PB15)* 30(PA9)* 31(PA10)* 32(PA11)* 33(PA12)* 38(PA15)* 40(PB4)* 41(PB5)* 45(PB8)* 46(PB9)*

### Notes on the sheet
- (near HL1) Status LED
- (near X9) Debug UART Connector
- MCU SWD Connector
- Перв. примен.
- Справ. №
- Подп. и дата
- Инв. № дубл.
- Взам. инв. №
- Изм.
- Лист
- № докум.
- Подп.
- Дата
- Т.контр.
- Пров.
- Разраб.
- Лит.
- Листов
- Инв. № подл.
- Н.контр.
- Утв.
- Копировал
- Формат А3
- (in symbol PRAB31S) SSR

### Library data of the parts
C14 C15 = CL10C100CB8NNNC: Конденсатор; Точность: ±0.25pF; Напряжение: 50V; Диэлектрик: NP0; Производитель: Samsung Electro-Mechanics; Описание: 10 pF ±0.25pF 50V Ceramic Capacitor C0G, NP0 0603 (1608 Metric); Корпус: 0603 (1608 Metric); Температурный диапазон: -55°C ~ 125°C; Вид монтажа: SMD; Артикул: CL10C100CB8NNNC; Номинал: 10pF; Строка для документации: https://www.samsungsem.com/resources/file/global/support/product_catalog/MLCC.pdf; Тип элемента: Конденсатор
C16-C20 C22 = CL10B104KB8NNNC: as C3 on sheet LOOP_DAC; Артикул: CL10B104KB8NNNC; Номинал: 0.1uF; Строка для документации: https://mm.digikey.com/Volume0/opasdata/d220001/medias/docus/609/CL10B104KB8NNNC_Spec.pdf; Тип элемента: Конденсатор
C21 = CL21A475KAQNNNG: as C2 on sheet LOOP_DAC; Артикул: CL21A475KAQNNNG; Номинал: 4.7uF; Строка для документации: https://mm.digikey.com/Volume0/opasdata/d220001/medias/docus/41/CL21A475KAQNNNG_DS.pdf; Тип элемента: Конденсатор
C23 = CC0603KRX7R9BB105: as C10 on sheet LOOP_DAC; Артикул: CC0603KRX7R9BB105; Номинал: 1uF; Строка для документации: https://www.yageo.com/upload/media/product/productsearch/datasheet/mlcc/UPY-GPHC_X7R_6.3V-to-250V_24.pdf; Тип элемента: Конденсатор
DD2 = STM32F103C8T6: Микросхема микроконтроллер; Производитель: STMicroelectronics; Описание: ARM® Cortex®-M3 STM32F1 Microcontroller IC 32-Bit Single-Core 72MHz 64KB (64K x 8) FLASH; Корпус: 48-LQFP (9x9); Температурный диапазон: -40°C ~ 85°C (TA); Вид монтажа: SMD; Артикул: STM32F103C8T6; Строка для документации: https://www.st.com/resource/en/datasheet/stm32f103cb.pdf; Тип элемента: Микросхема
FU2 = 0ZCJ0005FF2E: as FU1 on sheet LOOP_DAC; Артикул: 0ZCJ0005FF2E; Ток: 50mA; Строка для документации: https://www.belfuse.com/resources/datasheets/circuitprotection/ds-cp-0zcj-series.pdf; Тип элемента: Предохранитель
HL1 = KP-1608MGC: Светодиод; Прямой ток: 20mA; Напряжение: 2.5V; Яркость: 70mcd; Цвет: Зеленый; Длина волны: 570nm; Производитель: Kingbright; Описание: Green 570nm LED Indication - Discrete 2.5V 0603 (1608 Metric); Корпус: 0603 (1608 Metric); Температурный диапазон: -40°C ~ 80°C; Вид монтажа: SMD; Тип элемента: Диод светоизлучающий; Артикул: KP-1608MGC; Строка для документации: https://docs.rs-online.com/4930/0900766b8032f177.pdf
L1 = BLM18AG601SN1D: Фильтр ЭМП индуктивный; Ток: 500mA; Сопротивление: 380m; Тип: Ferrite Bead; Производитель: Murata Electronics; Описание: 600 Ohms @ 100 MHz 1 Ferrite Bead 0603 (1608 Metric) 500mA 380mOhm; Корпус: 0603 (1608 Metric); Температурный диапазон: -55°C ~ 125°C; Вид монтажа: SMD; Артикул: BLM18AG601SN1D; Номинал: 600 @ 100MHz; Строка для документации: https://www.murata.com/en-us/products/productdata/8796738650142/ENFA0003.pdf; Тип элемента: Фильтр ЭМП
R11 = RC0603FR-07560RL: Резистор; Точность: 1%; ТКС: ±100ppm/°C; Напряжение: 75V; Производитель: YAGEO; Описание: 560 Ohms ±1% 0.1W, 1/10W Chip Resistor 0603 (1608 Metric) Moisture Resistant Thick Film; Корпус: 0603 (1608 Metric); Температурный диапазон: -55°C ~ 155°C; Вид монтажа: SMD; Артикул: RC0603FR-07560RL; Номинал: 560; Строка для документации: https://www.yageo.com/upload/media/product/app/datasheet/rchip/pyu-rc_group_51_rohs_l.pdf; Тип элемента: Резистор
R12 R13 R15-R22 = RC0603FR-0710KL: Резистор; Точность: 1%; ТКС: ±100ppm/°C; Напряжение: 75V; Производитель: YAGEO; Описание: 10 kOhms ±1% 0.1W, 1/10W Chip Resistor 0603 (1608 Metric) Moisture Resistant Thick Film; Корпус: 0603 (1608 Metric); Температурный диапазон: -55°C ~ 155°C; Вид монтажа: SMD; Артикул: RC0603FR-0710KL; Номинал: 10k; Строка для документации: https://www.yageo.com/upload/media/product/app/datasheet/rchip/pyu-rc_group_51_rohs_l.pdf; Тип элемента: Резистор
R14 = RC0603FR-071KL: Резистор; Точность: 1%; ТКС: ±100ppm/°C; Напряжение: 75V; Производитель: YAGEO; Описание: 1 kOhms ±1% 0.1W, 1/10W Chip Resistor 0603 (1608 Metric) Moisture Resistant Thick Film; Корпус: 0603 (1608 Metric); Температурный диапазон: -55°C ~ 155°C; Вид монтажа: SMD; Артикул: RC0603FR-071KL; Номинал: 1k; Строка для документации: https://www.yageo.com/upload/media/product/app/datasheet/rchip/pyu-rc_group_51_rohs_l.pdf; Тип элемента: Резистор
U1 = PRAB31S: Твердотельное реле, SPST-NO; Контактная группа: SPST-NO (1 Form A); Напряжение обмотки: 1.3V; Ток коммутируемый: 120mA; Напряжение коммутируемое: 350V; Описание: Solid State SPST-NO (1 Form A) 4-SOP (0.173", 4.40mm); Тип: Solid State Relay; Производитель: АО Протон; Температурный диапазон: -55°C ~ 100°C; Вид монтажа: SMD; Артикул: PRAB31S; Строка для документации: https://optron.proton-orel.ru/upload/library/catalog/optrony-2024.pdf; Тип элемента: Твердотельное реле
VD4 = SMAJ58CA-TR: TVS диод двунаправленный; Напряжение: 58V; Напряжение ограничения: 121V; Напряжение пробоя: 64.4V; Ток: 19A; Тип: TVS Bidirectional; Производитель: STMicroelectronics; Описание: 121V Clamp 19A (8/20µs) Ipp Tvs Diode Surface Mount DO-214AC (SMA); Корпус: DO-214AC, SMA; Температурный диапазон: -55°C ~ 150°C (TJ); Вид монтажа: SMD; Тип элемента: Диод защитный; Артикул: SMAJ58CA-TR; Строка для документации: https://www.st.com/resource/en/datasheet/cd00001333.pdf
X9 X10 = DS1021-1X4SF11-B: Разъем, 4 контакта; Тип разъема: Header, Male Pin; Количество контактов: 4; Шаг контактов: 2.54mm; Ток: 3A; Напряжение: 250V; Производитель: Connfly electronic (Zhenqin); Описание: Connector Header Through Hole 4 position 0.100" (2.54mm); Температурный диапазон: -40°C ~ 105°C; Вид монтажа: Through Hole; Артикул: DS1021-1X4SF11-B; Строка для документации: http://cn.connfly.group/static/upload/file/pdf/DS1021.pdf; Тип элемента: Разъем
ZQ1 = NX3225SA-16.000M-STD-CRS-2: Кварцевый резонатор, экранированный; Точность: ±15ppm; Описание: 16 MHz ±15ppm Crystal 8pF 80 Ohms 4-SMD, No Lead; Тип: MHz Crystal; Производитель: NDK (NIHON DEMPA KOGYO CO., LTD); Температурный диапазон: -40°C ~ 85°C; Корпус: 3.20mm x 2.50mm; Вид монтажа: SMD; Артикул: NX3225SA-16.000M-STD-CRS-2; Частота: 16MHz; Строка для документации: https://www.ndk.com/images/products/catalog/c_NX3225SA_e.pdf; Тип элемента: Кварцевый резонатор

## Sheet SERIAL_IF.SchDoc: {Наименование}
size 420 x 297 mm; ApprovedBy: {Утвердил}; CheckedBy: {Проверил}; DrawnBy: {Разраб.}; DocumentNumber: AN IF Converter v.1.0; SheetNumber: 4; SheetTotal: 6; Scale: {Мш.}; PageSetup: Record=PageOptions|CenterHorizontal=False|CenterVertical=False|PrintScale=0.95|XCorrection=0.00|YCorrection=0.00|PrintKind=1|BorderSize=5000000|LeftOffset=0|BottomOffset=0|Orientation=1|PaperLength=1000|PaperWidth=1000|Scale=100|PaperSource=15|PrintQuality=600|MediaType=1|DitherType=10|PaperKind=A4|PrintScaleMode=1; ProcessInspection: {Т.контр.}; Mass: {М.}; NormInspection: {Н.контр.}; Letter1Column: {}; Letter2Column: {}; Letter3Column: {}; DocumentType: {Документ}; Rule: PcbType=ProtelPcb
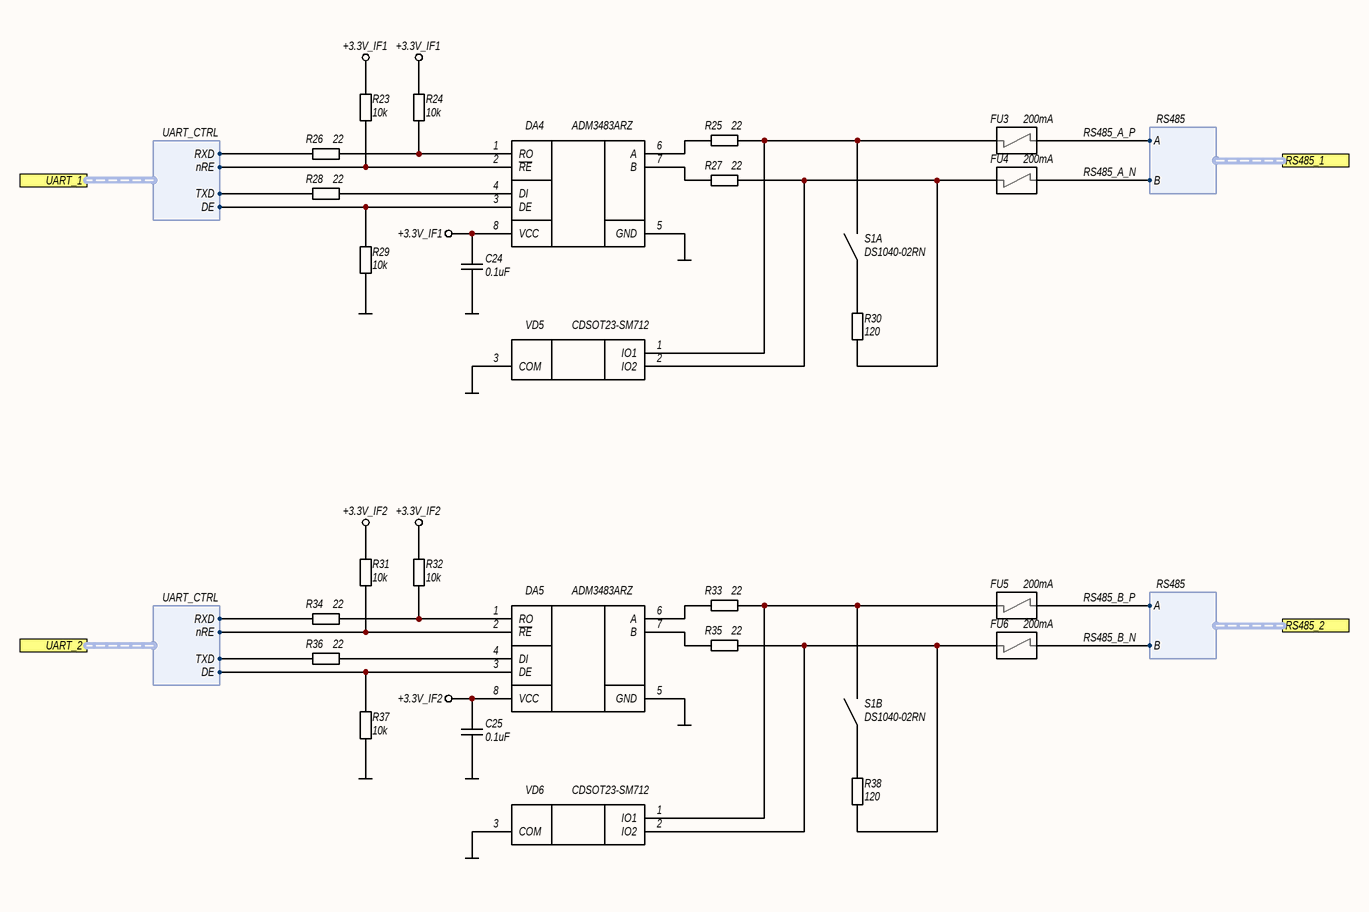
[diagram p3: SERIAL_IF.SchDoc]

### Parts
C24  0.1uF  [C0603N]
C25  0.1uF  [C0603N]
DA4  ADM3483ARZ  [SOIC8]
DA5  ADM3483ARZ  [SOIC8]
FU3  200mA  [TBU-CA]
FU4  200mA  [TBU-CA]
FU5  200mA  [TBU-CA]
FU6  200mA  [TBU-CA]
R23  10k  [R0603N]
R24  10k  [R0603N]
R25  22  [R0805N]
R26  22  [R0603N]
R27  22  [R0805N]
R28  22  [R0603N]
R29  10k  [R0603N]
R30  120  [R1206N]
R31  10k  [R0603N]
R32  10k  [R0603N]
R33  22  [R0805N]
R34  22  [R0603N]
R35  22  [R0805N]
R36  22  [R0603N]
R37  10k  [R0603N]
R38  120  [R1206N]
S1  DS1040-02RN  [DIP_SWITCH_02P_STR_RA_TH]  (parts A,B of 2)
VD5  CDSOT23-SM712  [SOT23]
VD6  CDSOT23-SM712  [SOT23]

### Ports
RS485_1 (harness RS485), RS485_2 (harness RS485), UART_1 (harness UART_CTRL), UART_2 (harness UART_CTRL)

### Harnesses
UART_CTRL: RXD, nRE, TXD, DE
RS485: A, B

### Nets
+3.3V_IF1: C24.1 DA4.8(VCC) R23.1 R24.1
+3.3V_IF2: C25.1 DA5.8(VCC) R31.1 R32.1
GND: C24.2 C25.2 DA4.5(GND) DA5.5(GND) R29.2 R37.2 VD5.3(COM) VD6.3(COM)
MCU_UART2_DE: DA4.3(DE) R29.1 ; port UART_1.DE
MCU_UART2_nRE: DA4.2(~{RE}) R23.2 ; port UART_1.nRE
MCU_UART2_RX: R26.2 ; port UART_1.RXD
MCU_UART2_TX: R28.2 ; port UART_1.TXD
MCU_UART3_DE: DA5.3(DE) R37.1 ; port UART_2.DE
MCU_UART3_nRE: DA5.2(~{RE}) R31.2 ; port UART_2.nRE
MCU_UART3_RX: R34.2 ; port UART_2.RXD
MCU_UART3_TX: R36.2 ; port UART_2.TXD
RS485_A_N: FU4.3(IN/OUT) ; port RS485_1.B
RS485_A_P: FU3.3(IN/OUT) ; port RS485_1.A
RS485_B_N: FU6.3(IN/OUT) ; port RS485_2.B
RS485_B_P: FU5.3(IN/OUT) ; port RS485_2.A
NetDA4_1: DA4.1(RO) R24.2 R26.1
NetDA4_4: DA4.4(DI) R28.1
NetDA4_6: DA4.6(A) R25.2
NetDA4_7: DA4.7(B) R27.2
NetDA5_1: DA5.1(RO) R32.2 R34.1
NetDA5_4: DA5.4(DI) R36.1
NetDA5_6: DA5.6(A) R33.2
NetDA5_7: DA5.7(B) R35.2
NetFU3_1: FU3.1(IN/OUT) R25.1 S1.4 VD5.1(IO1)
NetFU4_1: FU4.1(IN/OUT) R27.1 R30.2 VD5.2(IO2)
NetFU5_1: FU5.1(IN/OUT) R33.1 S1.3 VD6.1(IO1)
NetFU6_1: FU6.1(IN/OUT) R35.1 R38.2 VD6.2(IO2)
NetR30_1: R30.1 S1.1
NetR38_1: R38.1 S1.2

### Notes on the sheet
- Перв. примен.
- Справ. №
- Подп. и дата
- Инв. № дубл.
- Взам. инв. №
- Изм.
- Лист
- № докум.
- Подп.
- Дата
- Т.контр.
- Пров.
- Разраб.
- Лит.
- Листов
- Инв. № подл.
- Н.контр.
- Утв.
- Копировал
- Формат А3

### Library data of the parts
C24 C25 = CL10B104KB8NNNC: as C3 on sheet LOOP_DAC; Артикул: CL10B104KB8NNNC; Номинал: 0.1uF; Строка для документации: https://mm.digikey.com/Volume0/opasdata/d220001/medias/docus/609/CL10B104KB8NNNC_Spec.pdf; Тип элемента: Конденсатор
DA4 DA5 = ADM3483ARZ: Микросхема приемопередатчика RS-485; Производитель: Analog Devices Inc.; Описание: 1/1 Transceiver Half RS422, RS485 8-SOIC; Корпус: 8-SOIC (0.154", 3.90mm Width); Температурный диапазон: -40°C ~ 85°C; Вид монтажа: SMD; Артикул: ADM3483ARZ; Строка для документации: https://www.analog.com/media/en/technical-documentation/data-sheets/ADM3483_3485_3488_3490_3491.pdf; Тип элемента: Микросхема
FU3-FU6 = TBU-CA065-200-WH: Полупроводниковый предохранитель; Напряжение ограничения: 650V; Тип: Surge Suppression IС; Производитель: Bourns Inc.; Описание: SURGE SUPP TBU 200MA 650VIMP SMD; Корпус: 6.50mm x 4.00mm; Температурный диапазон: -55°C ~ 125°C; Вид монтажа: SMD; Артикул: TBU-CA065-200-WH; Ток: 200mA; Строка для документации: https://www.bourns.com/docs/Product-Datasheets/TBU-CA.pdf; Тип элемента: Предохранитель
R23 R24 R29 R31 R32 R37 = RC0603FR-0710KL: as R12 on sheet MCU; Артикул: RC0603FR-0710KL; Номинал: 10k; Строка для документации: https://www.yageo.com/upload/media/product/app/datasheet/rchip/pyu-rc_group_51_rohs_l.pdf; Тип элемента: Резистор
R25 R27 R33 R35 = RC0805FR-0722RL: Резистор; Точность: 1%; ТКС: ±100ppm/°C; Напряжение: 150V; Производитель: YAGEO; Описание: 22 Ohms ±1% 0.125W, 1/8W Chip Resistor 0805 (2012 Metric) Moisture Resistant Thick Film; Корпус: 0805 (2012 Metric); Температурный диапазон: -55°C ~ 155°C; Вид монтажа: SMD; Артикул: RC0805FR-0722RL; Номинал: 22; Строка для документации: https://www.yageo.com/upload/media/product/productsearch/datasheet/rchip/PYu-RC_Group_51_RoHS_L_12.pdf; Тип элемента: Резистор
R26 R28 R34 R36 = RC0603FR-0722RL: as R4 on sheet LOOP_DAC; Артикул: RC0603FR-0722RL; Номинал: 22; Строка для документации: https://www.yageo.com/upload/media/product/app/datasheet/rchip/pyu-rc_group_51_rohs_l.pdf; Тип элемента: Резистор
R30 R38 = RC1206FR-07120RL: Резистор; Точность: 1%; ТКС: ±100ppm/°C; Напряжение: 75V; Производитель: YAGEO; Описание: 120 Ohms ±1% 0.25W, 1/4W Chip Resistor 1206 (3216 Metric) Moisture Resistant Thick Film; Корпус: 1206 (3216 Metric); Температурный диапазон: -55°C ~ 155°C; Вид монтажа: SMD; Артикул: RC1206FR-07120RL; Номинал: 120; Строка для документации: https://www.yageo.com/upload/media/product/productsearch/datasheet/rchip/PYu-RC_Group_51_RoHS_L_12.pdf; Тип элемента: Резистор
S1 = DS1040-02RN: Выключатель, DPST-NO; Производитель: Connfly electronic (Zhenqin); Ток: 0.1A; Напряжение: 24V; Описание: Dip Switch SPST 2 Position Through Hole Mount, 2.54mm Spacing, Slide (Standard) Actuator 100mA 24VDC; Вид монтажа: Through hole; Тип элемента: Переключатель; Артикул: DS1040-02RN; Конфигурация контактов: DPST-NO; Строка для документации: https://en.connfly.com/static/upload/file/pdf/DS1040.pdf
VD5 VD6 = CDSOT23-SM712: Сборка TVS диодов; Напряжение: 7.0V; Напряжение ограничения: 14V; Напряжение пробоя: 7.5V; Ток: 17A; Тип: TVS Bidirectional; Производитель: Bourns Inc.; Описание: 26V, 14V Clamp 17A (8/20µs) Ipp Tvs Diode Surface Mount SOT-23-3; Корпус: SOT-23-3; Температурный диапазон: -55°C ~ 150°C (TJ); Тип элемента: Диод защитный; Артикул: CDSOT23-SM712; Строка для документации: https://www.bourns.com/docs/Product-Datasheets/CDSOT23-SM712.pdf

## Sheet POWER.SchDoc: {Наименование}
size 420 x 297 mm; ApprovedBy: {Утвердил}; CheckedBy: {Проверил}; DrawnBy: {Разраб.}; DocumentNumber: AN IF Converter v.1.0; SheetNumber: 5; SheetTotal: 6; Scale: {Мш.}; PageSetup: Record=PageOptions|CenterHorizontal=False|CenterVertical=False|PrintScale=0.95|XCorrection=0.00|YCorrection=0.00|PrintKind=1|BorderSize=5000000|LeftOffset=0|BottomOffset=0|Orientation=1|PaperLength=1000|PaperWidth=1000|Scale=100|PaperSource=15|PrintQuality=600|MediaType=1|DitherType=10|PaperKind=A4|PrintScaleMode=1; ProcessInspection: {Т.контр.}; Mass: {М.}; NormInspection: {Н.контр.}; Letter1Column: {}; Letter2Column: {}; Letter3Column: {}; DocumentType: {Документ}; Rule: PcbType=ProtelPcb
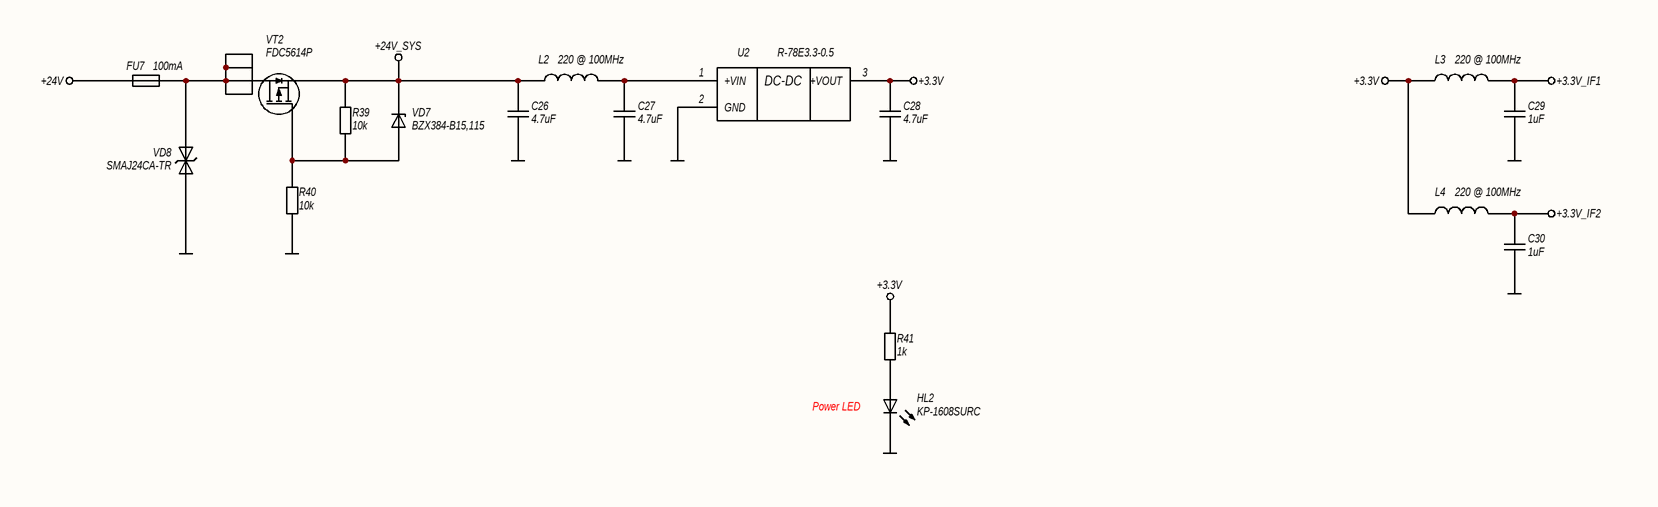
[diagram p4: POWER.SchDoc]

### Parts
C26  4.7uF  [C1206N]
C27  4.7uF  [C1206N]
C28  4.7uF  [C0805N]
C29  1uF  [C0603N]
C30  1uF  [C0603N]
FU7  100mA  [0ZCJ_0.85]
HL2  KP-1608SURC  [LED0603]
L2  220 @ 100MHz  [FB0603N]
L3  220 @ 100MHz  [FB0603N]
L4  220 @ 100MHz  [FB0603N]
R39  10k  [R0603N]
R40  10k  [R0603N]
R41  1k  [R0603N]
U2  R-78E3.3-0.5  [DC-DC_SIP3]
VD7  BZX384-B15,115  [SOD323]
VD8  SMAJ24CA-TR  [SMA]
VT2  FDC5614P  [TSOT23-6]

### Nets
+3.3V: C28.2 L3.1 L4.1 R41.1 U2.3(+VOUT)
+3.3V_IF1: C29.1 L3.2
+3.3V_IF2: C30.1 L4.2
+24V: FU7.2
+24V_SYS: C26.1 L2.1 R39.1 VD7.1(K) VT2.4(S)
GND: C26.2 C27.2 C28.1 C29.2 C30.2 HL2.1(K) R40.2 U2.2(GND) VD8.2(A2)
NetC27_1: C27.1 L2.2 U2.1(+VIN)
NetFU7_1: FU7.1 VD8.1(A1) VT2.1(D) VT2.2(D) VT2.5(D) VT2.6(D)
NetHL2_2: HL2.2(A) R41.2
NetR39_2: R39.2 R40.1 VD7.2(A) VT2.3(G)

### Notes on the sheet
- (near HL2) Power LED
- Перв. примен.
- Справ. №
- Подп. и дата
- Инв. № дубл.
- Взам. инв. №
- Изм.
- Лист
- № докум.
- Подп.
- Дата
- Т.контр.
- Пров.
- Разраб.
- Лит.
- Листов
- Инв. № подл.
- Н.контр.
- Утв.
- Копировал
- Формат А3
- (in symbol R-78E3.3-0.5) DC-DC

### Library data of the parts
C26 C27 = CC1206KKX7R9BB475: as C4 on sheet LOOP_DAC; Артикул: CC1206KKX7R9BB475; Номинал: 4.7uF; Тип элемента: Конденсатор
C28 = CL21A475KAQNNNG: as C2 on sheet LOOP_DAC; Артикул: CL21A475KAQNNNG; Номинал: 4.7uF; Строка для документации: https://mm.digikey.com/Volume0/opasdata/d220001/medias/docus/41/CL21A475KAQNNNG_DS.pdf; Тип элемента: Конденсатор
C29 C30 = CC0603KRX7R9BB105: as C10 on sheet LOOP_DAC; Артикул: CC0603KRX7R9BB105; Номинал: 1uF; Строка для документации: https://www.yageo.com/upload/media/product/productsearch/datasheet/mlcc/UPY-GPHC_X7R_6.3V-to-250V_24.pdf; Тип элемента: Конденсатор
FU7 = 0ZCJ0010FF2E: Плавкий предохранитель; Напряжение: 60V; Тип: PTC Resettable Fuse; Производитель: Bel Fuse Inc.; Описание: Polymeric PTC Resettable Fuse 60V 100 mA Ih Surface Mount 1206 (3216 Metric), Concave; Корпус: 1206 (3216 Metric), Concave; Температурный диапазон: -40°C ~ 85°C; Вид монтажа: SMD; Артикул: 0ZCJ0010FF2E; Ток: 100mA; Строка для документации: https://www.belfuse.com/resources/datasheets/circuitprotection/ds-cp-0zcj-series.pdf; Тип элемента: Предохранитель
HL2 = KP-1608SURC: Светодиод; Прямой ток: 20mA; Напряжение: 2.5V; Яркость: 200mcd; Цвет: Красный; Длина волны: 628nm; Производитель: Kingbright; Описание: Red 628nm LED Indication - Discrete 2.5V 0603 (1608 Metric); Корпус: 0603 (1608 Metric); Температурный диапазон: -40°C ~ 80°C; Вид монтажа: SMD; Тип элемента: Диод светоизлучающий; Артикул: KP-1608SURC; Строка для документации: https://docs.rs-online.com/ec7c/0900766b8032f182.pdf
L2-L4 = BLM18PG221SN1D: Фильтр ЭМП индуктивный; Ток: 1.4A; Сопротивление: 100m; Тип: Ferrite Bead; Производитель: Murata Electronics; Описание: 220 Ohms @ 100 MHz 1 Power Line Ferrite Bead 0603 (1608 Metric) 1.4A 100mOhm; Корпус: 0603 (1608 Metric); Температурный диапазон: -55°C ~ 125°C; Вид монтажа: SMD; Артикул: BLM18PG221SN1D; Номинал: 220 @ 100MHz; Строка для документации: https://www.murata.com/en-us/products/productdata/8796738650142/ENFA0003.pdf; Тип элемента: Фильтр ЭМП
R39 R40 = RC0603FR-0710KL: as R12 on sheet MCU; Артикул: RC0603FR-0710KL; Номинал: 10k; Строка для документации: https://www.yageo.com/upload/media/product/app/datasheet/rchip/pyu-rc_group_51_rohs_l.pdf; Тип элемента: Резистор
R41 = RC0603FR-071KL: as R14 on sheet MCU; Артикул: RC0603FR-071KL; Номинал: 1k; Строка для документации: https://www.yageo.com/upload/media/product/app/datasheet/rchip/pyu-rc_group_51_rohs_l.pdf; Тип элемента: Резистор
U2 = R-78E3.3-0.5: Модуль неизолированного DC-DC конвертера; Описание: Linear Regulator Replacement DC DC Converter 1 Output 3.3V 500mA 6V - 28V Input; Тип: DC-DC Converter; Производитель: Recom Power; Температурный диапазон: -40°C ~ 85°C; Вид монтажа: Through Hole; Тип элемента: DC-DC преобразователь; Артикул: R-78E3.3-0.5; Строка для документации: https://recom-power.com/pdf/Innoline/R-78E-0.5.pdf
VD7 = BZX384-B15,115: Стабилитрон; Прямой ток: 5mA; Напряжение: 15V; Производитель: Nexperia USA Inc.; Описание: Zener Diode 15 V 300 mW ±2% Surface Mount SOD-323; Корпус: SOD-323; Температурный диапазон: -65°C ~ 150°C; Вид монтажа: SMD; Тип элемента: Диод; Артикул: BZX384-B15,115; Тип: Zener; Строка для документации: https://assets.nexperia.com/documents/data-sheet/BZX384_SER.pdf
VD8 = SMAJ24CA-TR: TVS диод двунаправленный; Напряжение: 24V; Напряжение ограничения: 50V; Напряжение пробоя: 26.7V; Ток: 46A; Тип: TVS Bidirectional; Производитель: STMicroelectronics; Описание: 50V Clamp 46A (8/20µs) Ipp Tvs Diode Surface Mount DO-214AC (SMA); Корпус: DO-214AC, SMA; Температурный диапазон: -55°C ~ 150°C (TJ); Вид монтажа: SMD; Тип элемента: Диод защитный; Артикул: SMAJ24CA-TR; Строка для документации: https://www.st.com/resource/en/datasheet/cd00001333.pdf
VT2 = FDC5614P: МОП транзистор, P-канальный; Ток: -3A (Ta); Напряжение: -60V; Сопротивление канала: 105m; Пороговое напряжение: -3V; Тип: P-MOSFET; Производитель: onsemi; Описание: P-Channel 60 V 3A (Ta) 1.6W (Ta) Surface Mount SuperSOT™-6; Корпус: TSOT-23-6; Температурный диапазон: -55°C ~ 150°C (TJ); Вид монтажа: SMD; Тип элемента: Транзистор полевой; Артикул: FDC5614P; Строка для документации: https://www.onsemi.com/pdf/datasheet/fdc5614p-d.pdf

## Sheet MECHANICAL.SchDoc: {Наименование}
size 420 x 297 mm; ApprovedBy: {Утвердил}; CheckedBy: {Проверил}; DrawnBy: {Разраб.}; DocumentNumber: AN IF Converter v.1.0; SheetNumber: 6; SheetTotal: 6; Scale: {Мш.}; PageSetup: Record=PageOptions|CenterHorizontal=False|CenterVertical=False|PrintScale=0.95|XCorrection=0.00|YCorrection=0.00|PrintKind=1|BorderSize=5000000|LeftOffset=0|BottomOffset=0|Orientation=1|PaperLength=1000|PaperWidth=1000|Scale=100|PaperSource=15|PrintQuality=600|MediaType=1|DitherType=10|PaperKind=A4|PrintScaleMode=1; ProcessInspection: {Т.контр.}; Mass: {М.}; NormInspection: {Н.контр.}; Letter1Column: {}; Letter2Column: {}; Letter3Column: {}; DocumentType: {Документ}; Rule: PcbType=ProtelPcb
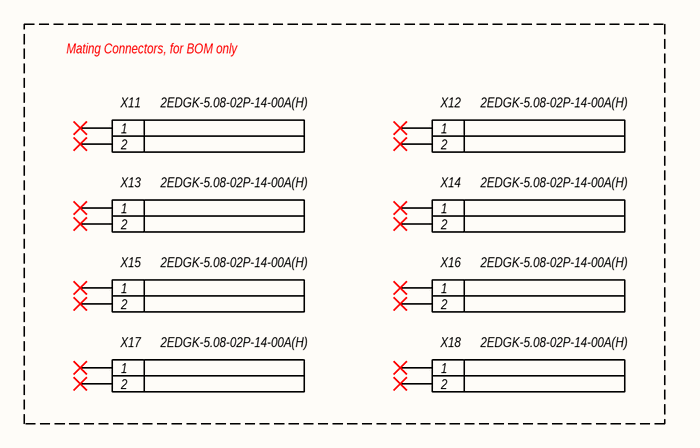
[diagram p5: MECHANICAL.SchDoc]

### Parts
X11  2EDGK-5.08-02P-14-00A(H)  [2EDGK-5.08-02P-14-00A(H)]
X12  2EDGK-5.08-02P-14-00A(H)  [2EDGK-5.08-02P-14-00A(H)]
X13  2EDGK-5.08-02P-14-00A(H)  [2EDGK-5.08-02P-14-00A(H)]
X14  2EDGK-5.08-02P-14-00A(H)  [2EDGK-5.08-02P-14-00A(H)]
X15  2EDGK-5.08-02P-14-00A(H)  [2EDGK-5.08-02P-14-00A(H)]
X16  2EDGK-5.08-02P-14-00A(H)  [2EDGK-5.08-02P-14-00A(H)]
X17  2EDGK-5.08-02P-14-00A(H)  [2EDGK-5.08-02P-14-00A(H)]
X18  2EDGK-5.08-02P-14-00A(H)  [2EDGK-5.08-02P-14-00A(H)]

### Blocks framed on the sheet
Mating Connectors, for BOM only: X11-X18

### Nets

Not connected (* = marked no-connect by the designer): X11 1* 2*; X12 1* 2*; X13 1* 2*; X14 1* 2*; X15 1* 2*; X16 1* 2*; X17 1* 2*; X18 1* 2*

### Notes on the sheet
- Перв. примен.
- Справ. №
- Подп. и дата
- Инв. № дубл.
- Взам. инв. №
- Изм.
- Лист
- № докум.
- Подп.
- Дата
- Т.контр.
- Пров.
- Разраб.
- Лит.
- Листов
- Инв. № подл.
- Н.контр.
- Утв.
- Копировал
- Формат А3

### Library data of the parts
X11-X18 = 2EDGK-5.08-02P-14-00A(H): Разъем, 2 контакта; Тип разъема: Pluggable terminal block; Количество контактов: 2; Шаг контактов: 5.08mm; Ток: 20A; Напряжение: 320V; Производитель: Degson Electronics; Описание: Pluggable terminal block; 5.08m; ways: 2; plug; female; Температурный диапазон: -40°C ~ 105°C; Вид монтажа: Through Hole; Артикул: 2EDGK-5.08-02P-14-00A(H); Строка для документации: https://static.chipdip.ru/lib/045/DOC013045856.pdf; Тип элемента: Разъем

## Nets that join several sheets
+3.3V: LOOP DAC (1C7.1 1DD1.1 1DD1.7), LOOP DAC (2C7.1 2DD1.1 2DD1.7), MCU (19 pins), POWER (5 pins)
+3.3V_IF1: SERIAL_IF (C24.1 DA4.8 R23.1 R24.1), POWER (C29.1 L3.2)
+3.3V_IF2: SERIAL_IF (C25.1 DA5.8 R31.1 R32.1), POWER (C30.1 L4.2)
+24V: TOP (X6.1 X7.1 X8.1), POWER (FU7.2)
GND: TOP (X6.2 X7.2 X8.2), LOOP DAC (1C7.2 1DD1.2 1DD1.8 1VU1.3), LOOP DAC (2C7.2 2DD1.2 2DD1.8 2VU1.3), MCU (22 pins), SERIAL_IF (8 pins), POWER (9 pins)
MCU_DAC1_nCS: LOOP DAC (1DD1.3), MCU (DD2.18 R18.1)
MCU_DAC1_nERR: LOOP DAC (1VU1.4), MCU (DD2.20 R20.1)
MCU_DAC2_nCS: LOOP DAC (2DD1.3), MCU (DD2.14 R19.1)
MCU_DAC2_nERR: LOOP DAC (2VU1.4), MCU (DD2.19 R21.1)
MCU_SPI1_MISO: LOOP DAC (1DD1.6), LOOP DAC (2DD1.6), MCU (DD2.16)
MCU_SPI1_MOSI: LOOP DAC (1DD1.5), LOOP DAC (2DD1.5), MCU (DD2.17)
MCU_SPI1_SCK: LOOP DAC (1DD1.4), LOOP DAC (2DD1.4), MCU (DD2.15)
MCU_UART2_DE: MCU (DD2.11), SERIAL_IF (DA4.3 R29.1)
MCU_UART2_nRE: MCU (DD2.10), SERIAL_IF (DA4.2 R23.2)
MCU_UART2_RX: MCU (DD2.13), SERIAL_IF (R26.2)
MCU_UART2_TX: MCU (DD2.12), SERIAL_IF (R28.2)
MCU_UART3_DE: MCU (DD2.27), SERIAL_IF (DA5.3 R37.1)
MCU_UART3_nRE: MCU (DD2.26), SERIAL_IF (DA5.2 R31.2)
MCU_UART3_RX: MCU (DD2.22), SERIAL_IF (R34.2)
MCU_UART3_TX: MCU (DD2.21), SERIAL_IF (R36.2)
Net1DA2_5: TOP (X1.2), LOOP DAC (5 pins)
Net1FU1_1: TOP (X1.1), LOOP DAC (1FU1.1)
Net2DA2_5: TOP (X4.2), LOOP DAC (5 pins)
Net2FU1_1: TOP (X4.1), LOOP DAC (2FU1.1)
NetFU2_1: TOP (X5.1), MCU (FU2.1)
NetU1_4: TOP (X5.2), MCU (U1.4 VD4.1)
RS485_A_N: TOP (X2.2), SERIAL_IF (FU4.3)
RS485_A_P: TOP (X2.1), SERIAL_IF (FU3.3)
RS485_B_N: TOP (X3.2), SERIAL_IF (FU6.3)
RS485_B_P: TOP (X3.1), SERIAL_IF (FU5.3)